# EAGLE design xen_teensy_motherboard_matrix_mki (EAGLE 9.6.0)
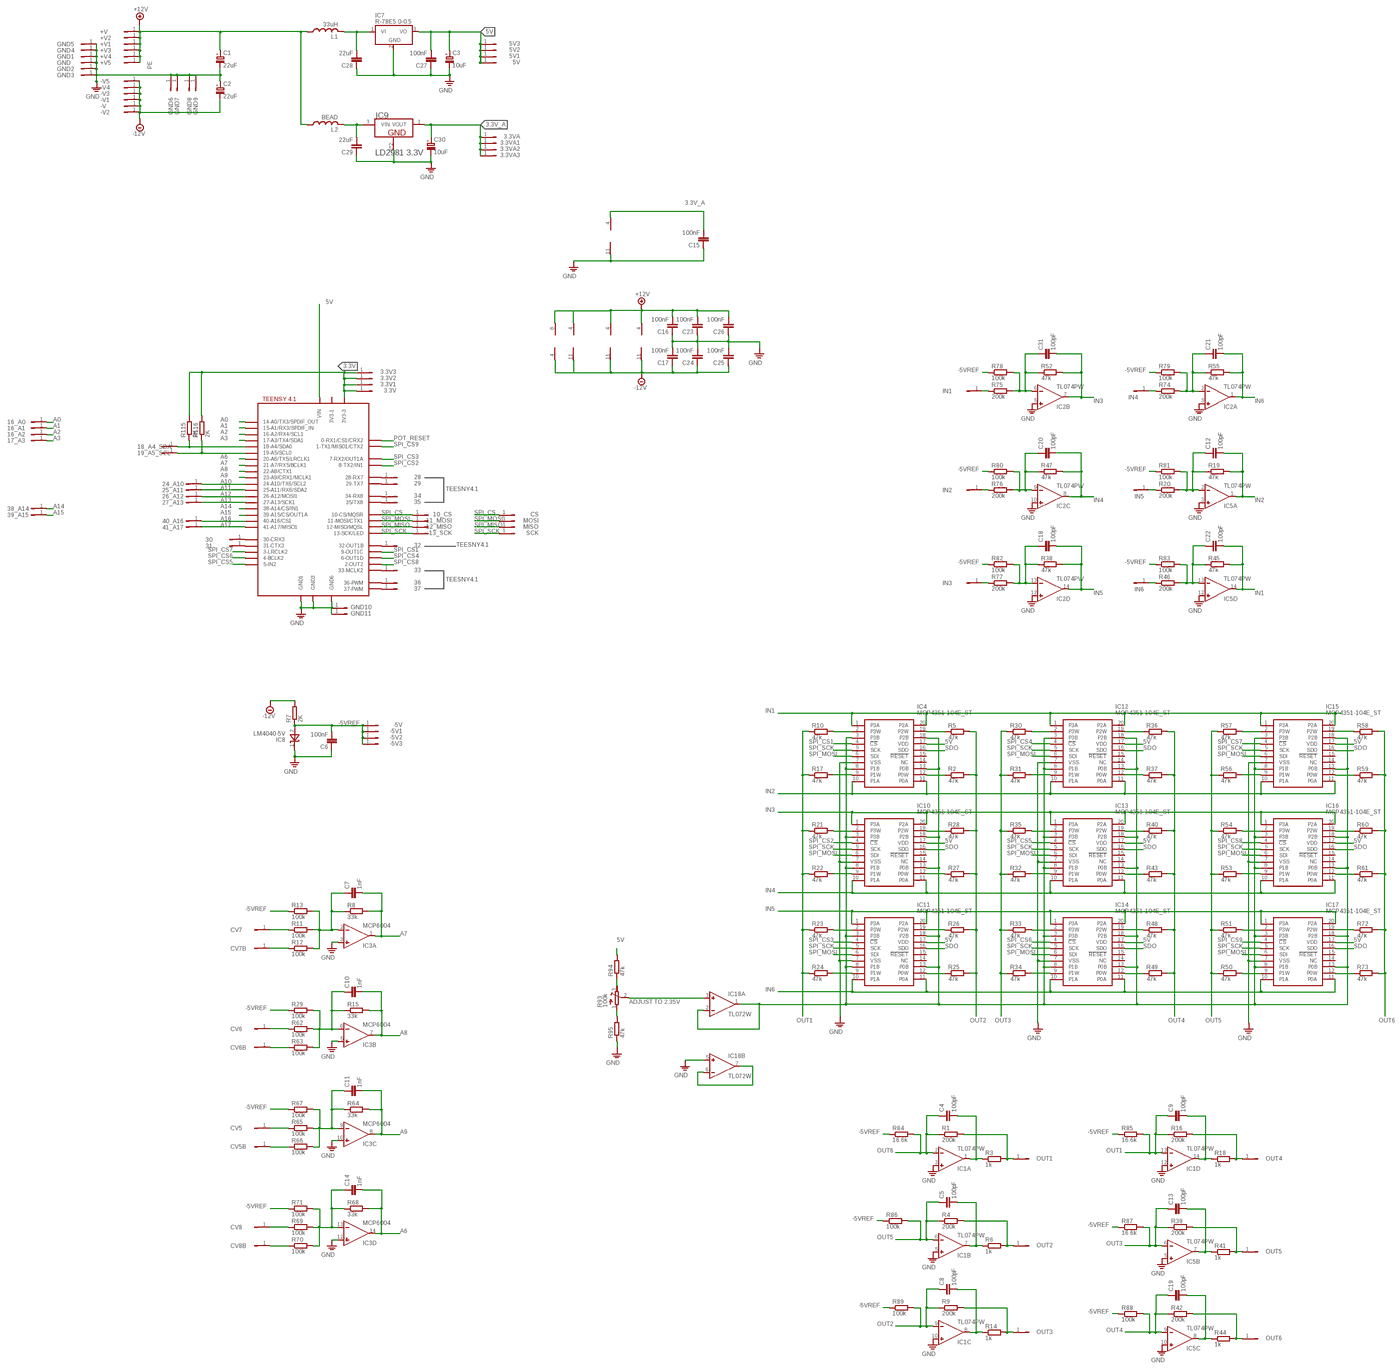
[diagram p0: schematic, sheet 1, overview]
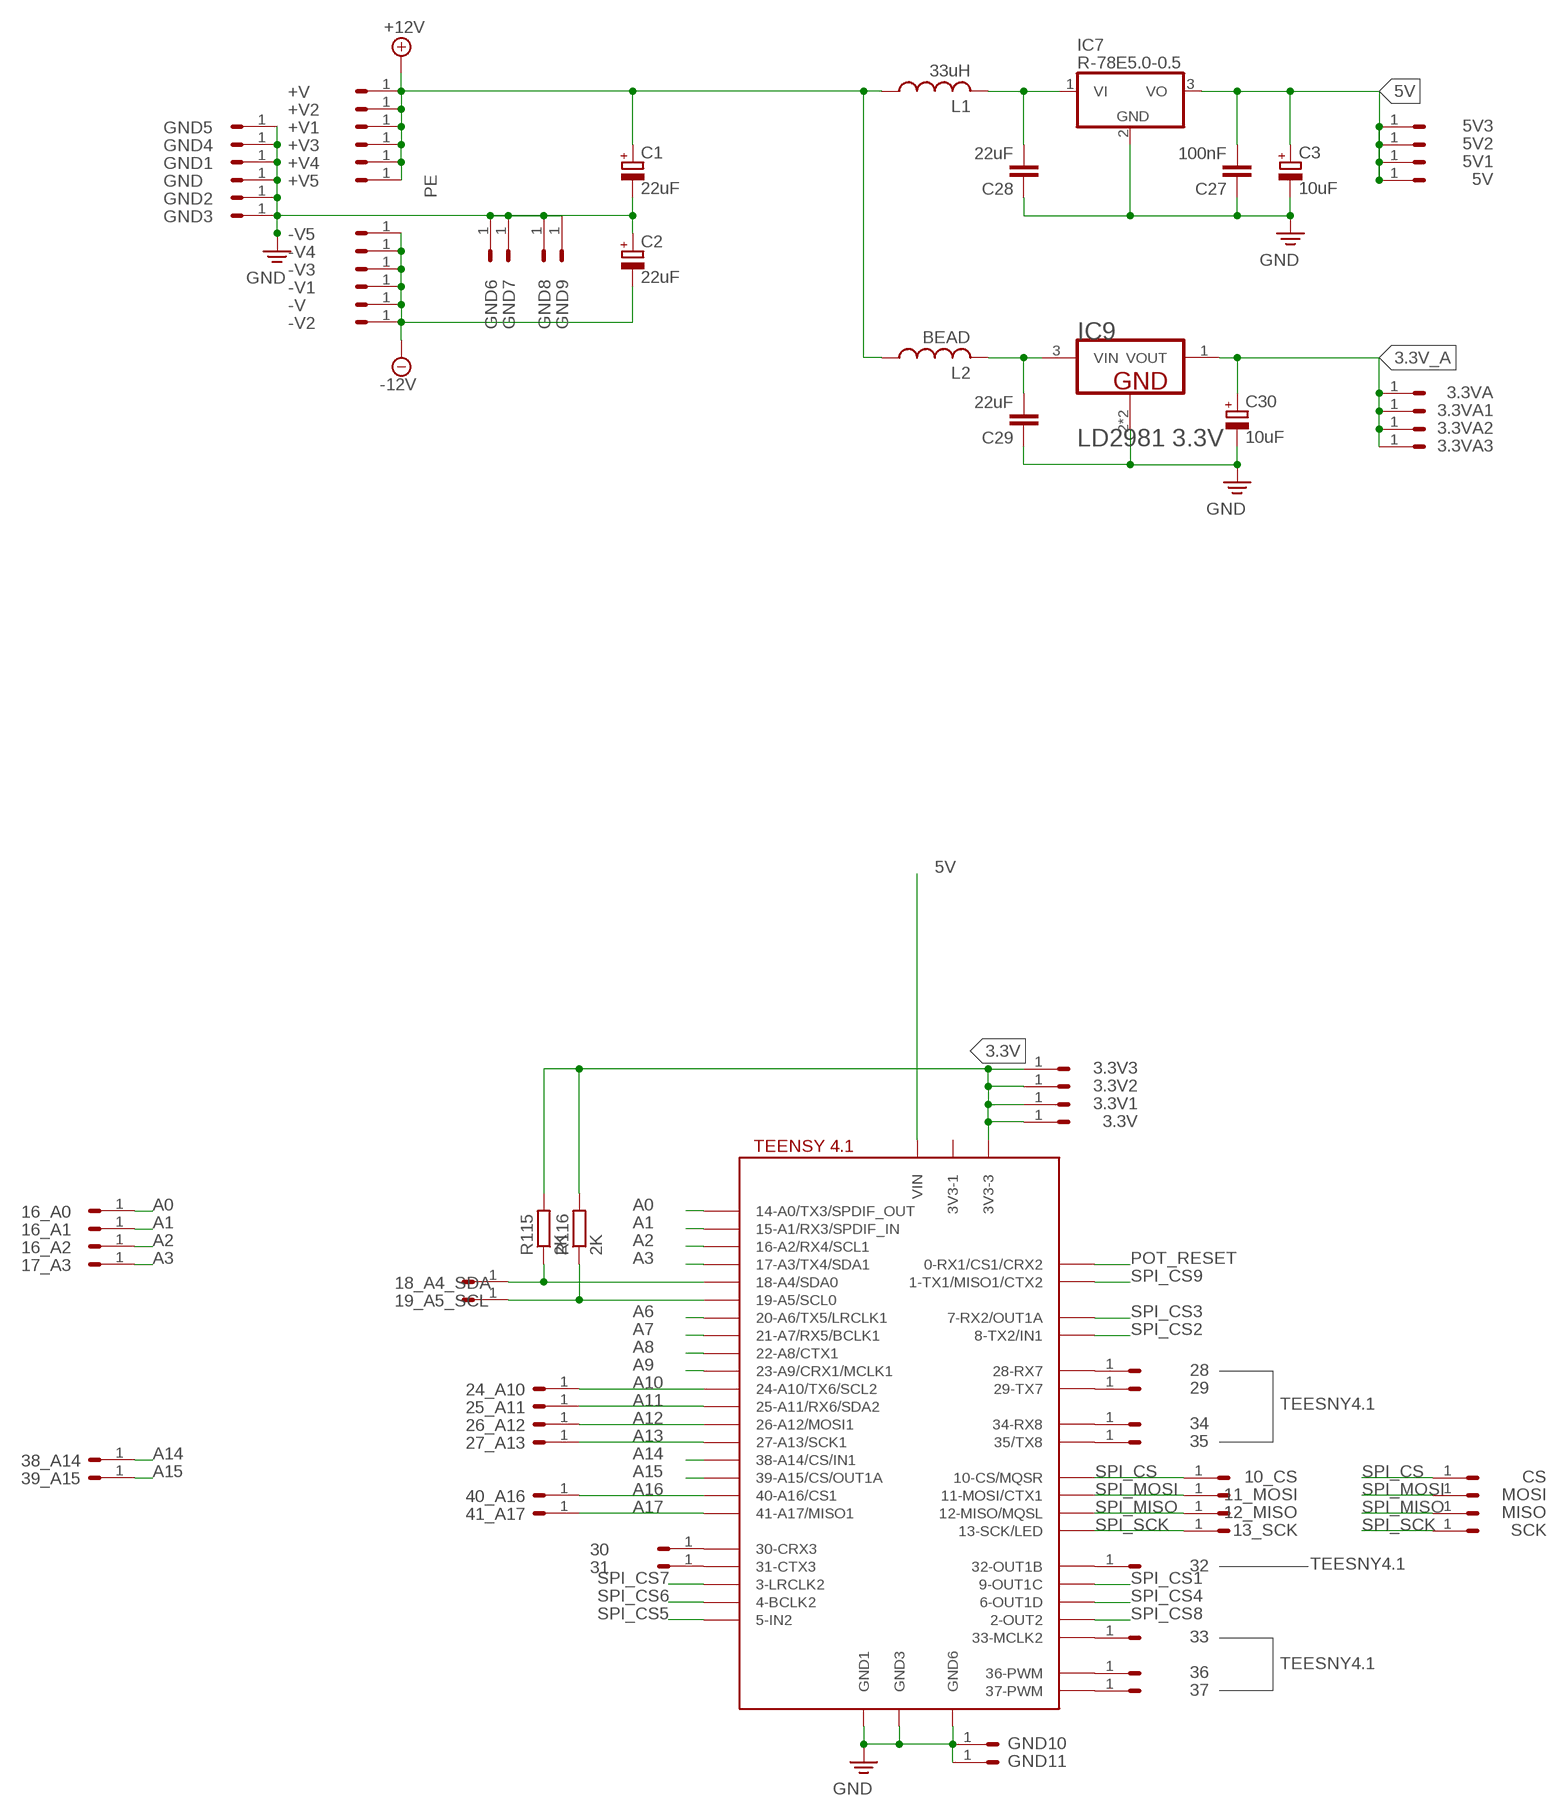
[diagram p1: schematic, sheet 1, part 1 of 4]
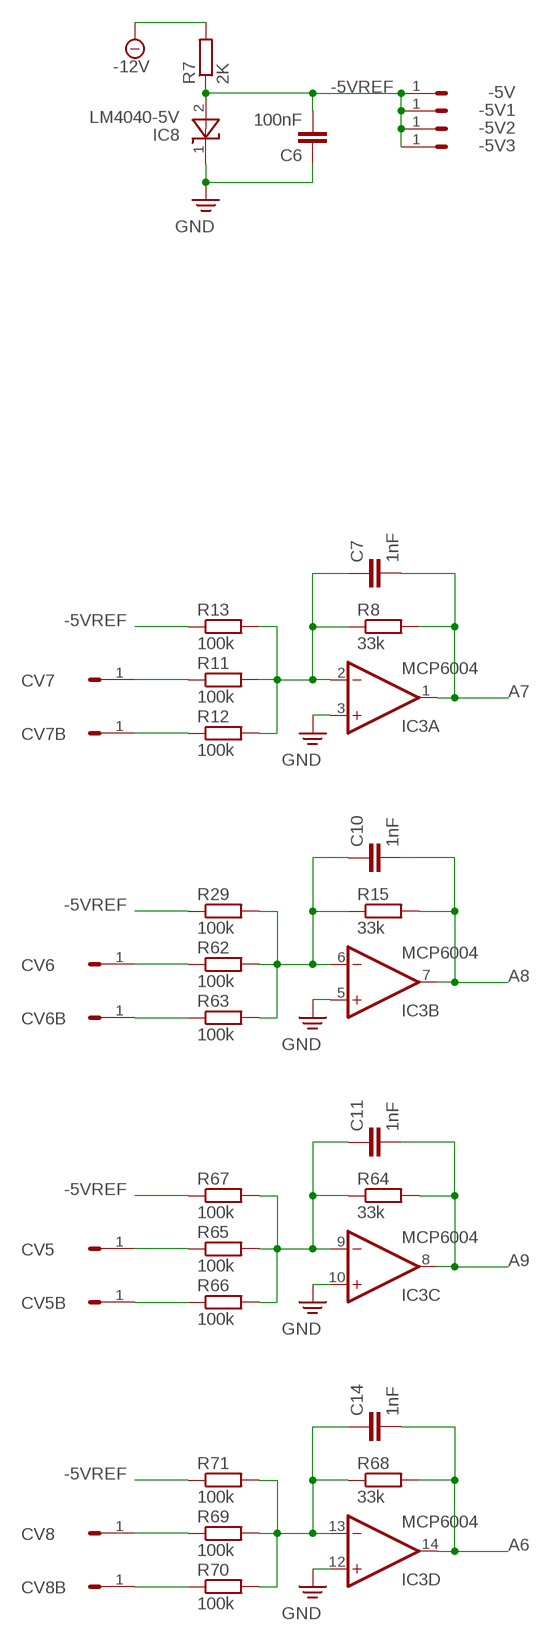
[diagram p2: schematic, sheet 1, part 2 of 4]
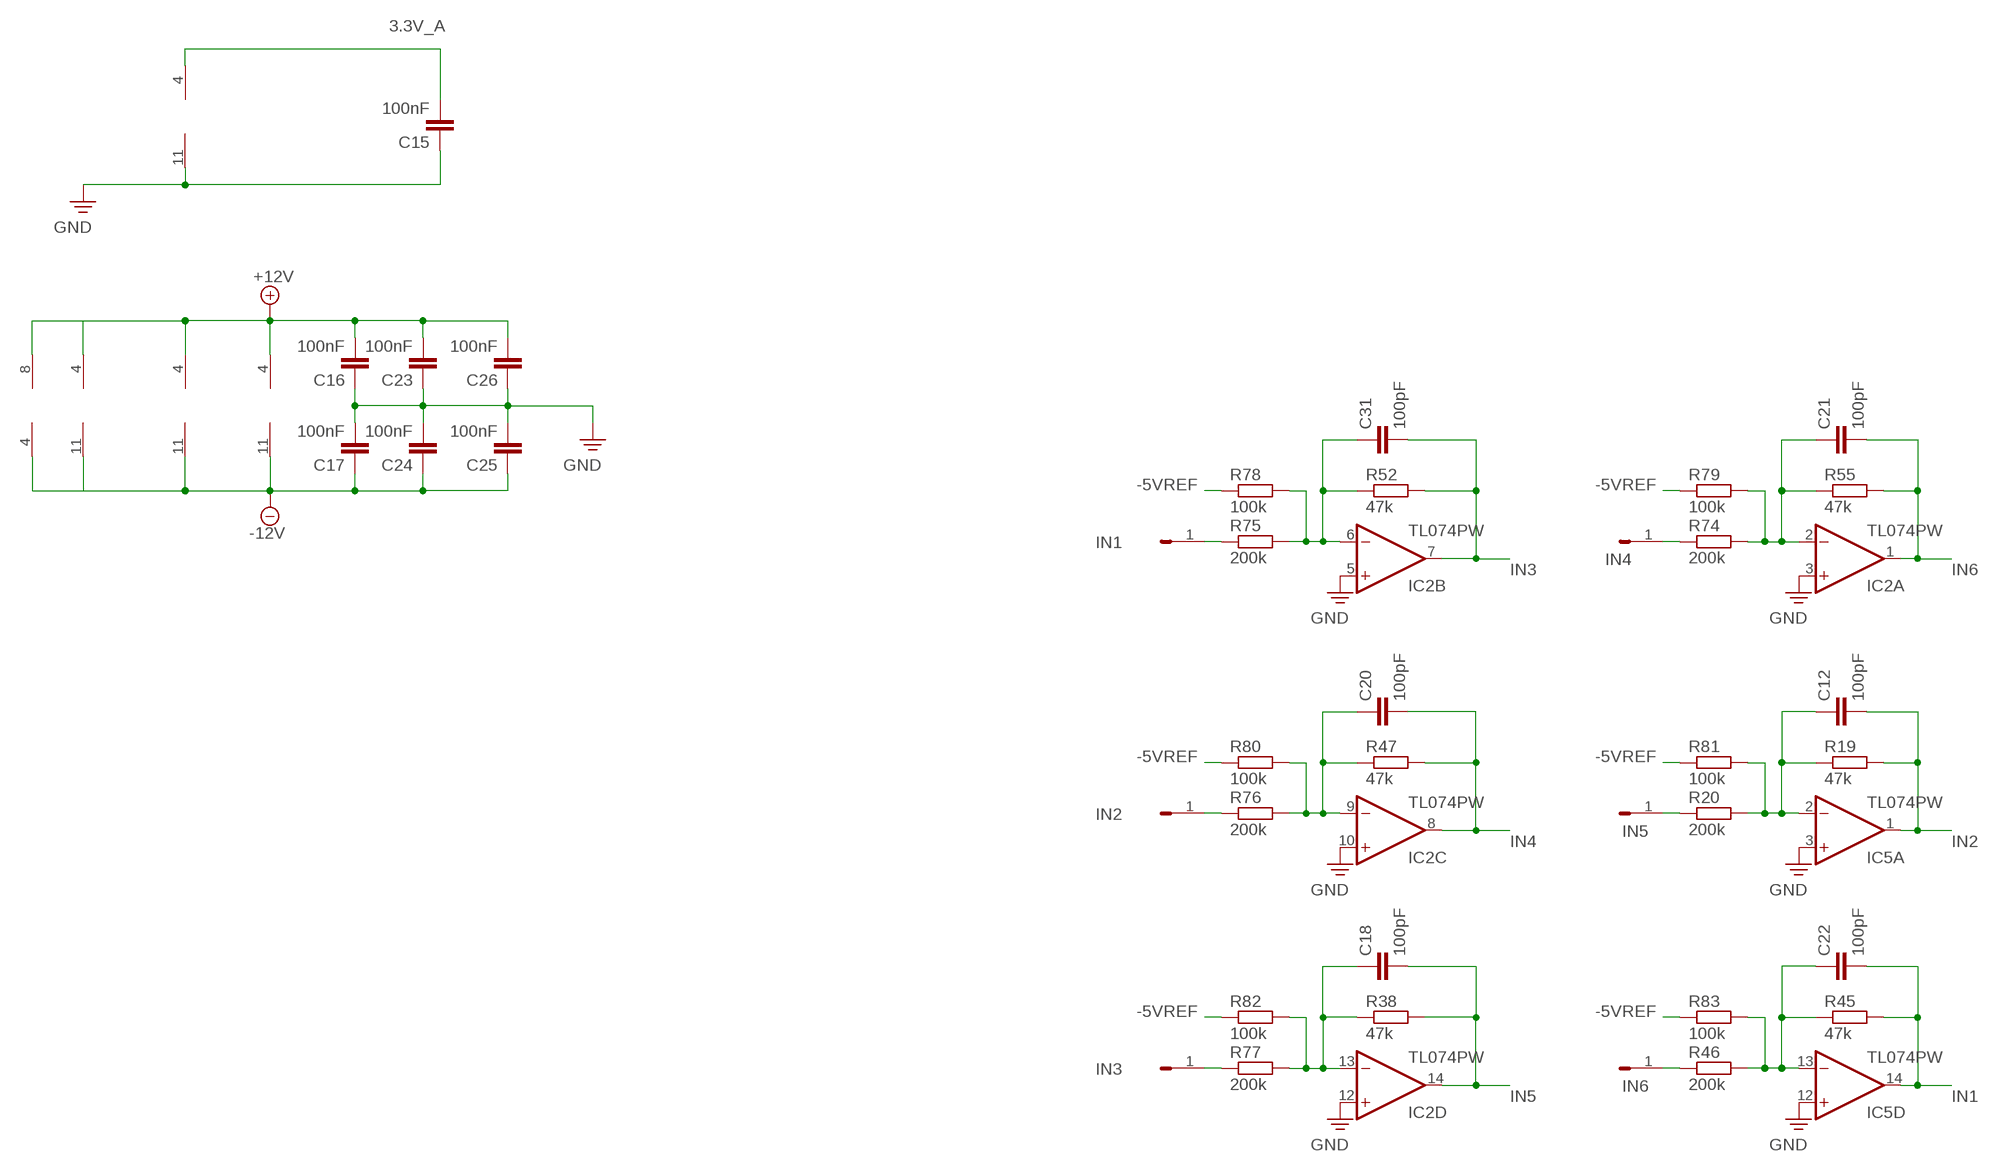
[diagram p3: schematic, sheet 1, part 3 of 4]
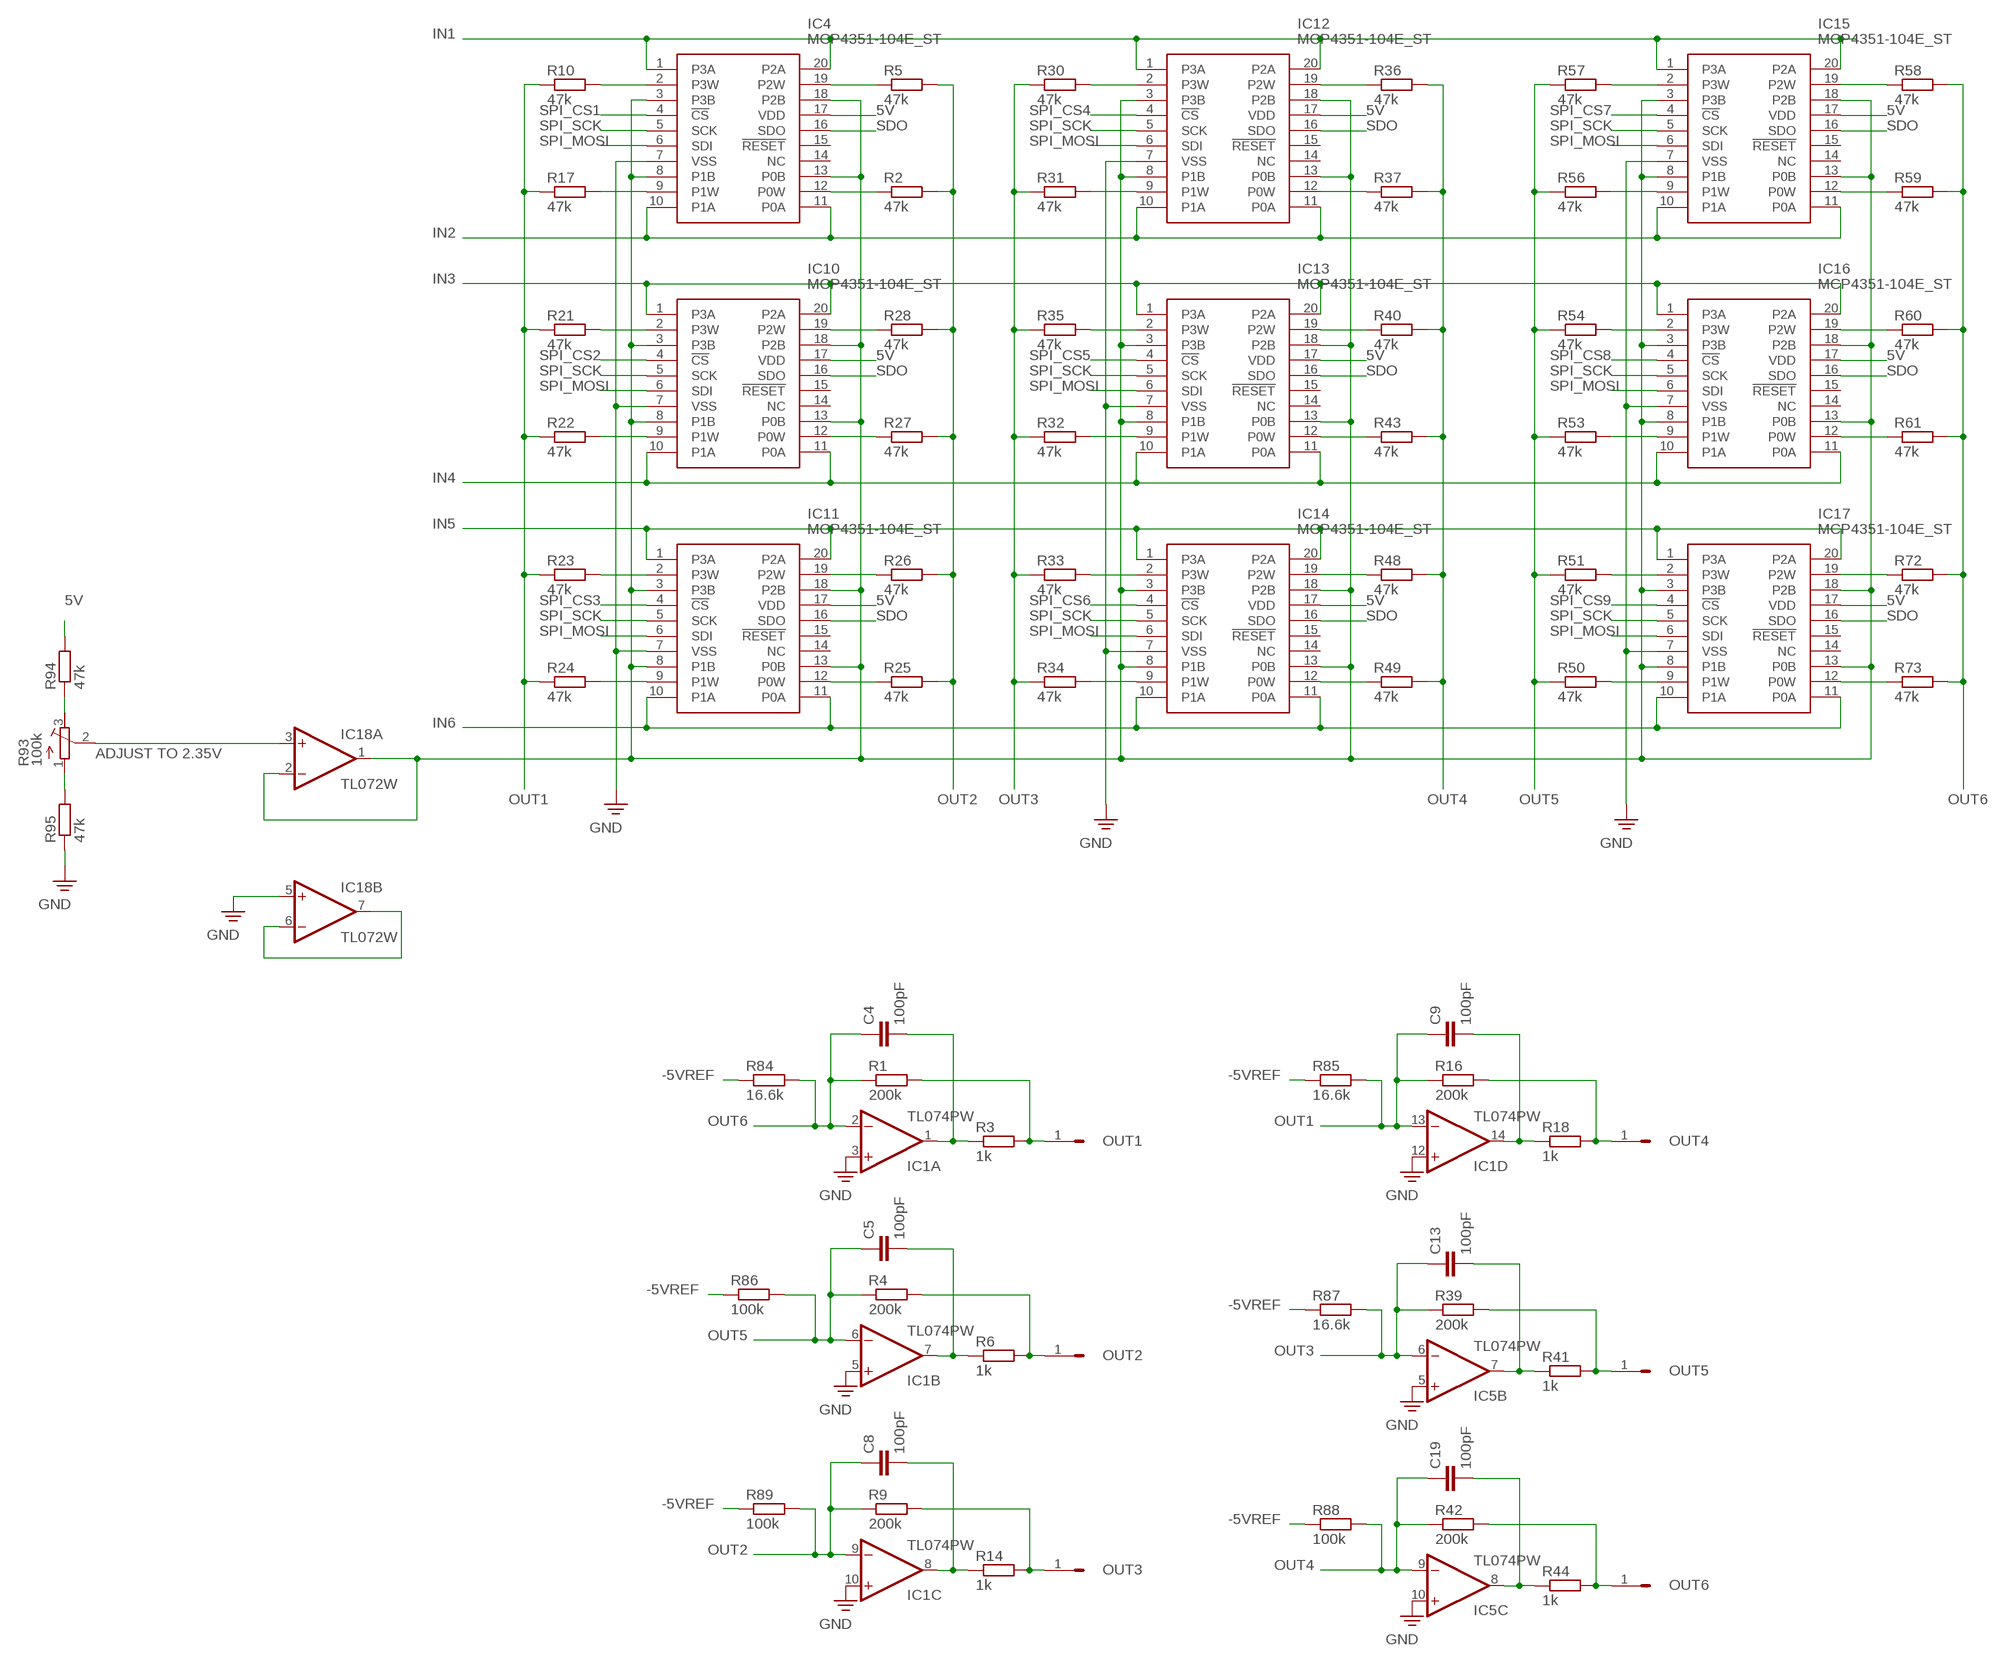
[diagram p4: schematic, sheet 1, part 4 of 4]

## Parts
3.3V  HEADER/MALE/01  [HEADER/MALE/01]
3.3V1  HEADER/MALE/01  [HEADER/MALE/01]
3.3V2  HEADER/MALE/01  [HEADER/MALE/01]
3.3V3  HEADER/MALE/01  [HEADER/MALE/01]
3.3VA  HEADER/MALE/01  [HEADER/MALE/01]
3.3VA1  HEADER/MALE/01  [HEADER/MALE/01]
3.3VA2  HEADER/MALE/01  [HEADER/MALE/01]
3.3VA3  HEADER/MALE/01  [HEADER/MALE/01]
5V  HEADER/MALE/01  [HEADER/MALE/01]
5V1  HEADER/MALE/01  [HEADER/MALE/01]
5V2  HEADER/MALE/01  [HEADER/MALE/01]
5V3  HEADER/MALE/01  [HEADER/MALE/01]
10_CS  HEADER/MALE/01  [HEADER/MALE/01]
11_MOSI  HEADER/MALE/01  [HEADER/MALE/01]
12_MISO  HEADER/MALE/01  [HEADER/MALE/01]
13_SCK  HEADER/MALE/01  [HEADER/MALE/01]
16_A0  HEADER/MALE/01  [HEADER/MALE/01]
16_A1  HEADER/MALE/01  [HEADER/MALE/01]
16_A2  HEADER/MALE/01  [HEADER/MALE/01]
17_A3  HEADER/MALE/01  [HEADER/MALE/01]
18_A4_SDA  HEADER/MALE/01  [HEADER/MALE/01]
19_A5_SCL  HEADER/MALE/01  [HEADER/MALE/01]
24_A10  HEADER/MALE/01  [HEADER/MALE/01]
25_A11  HEADER/MALE/01  [HEADER/MALE/01]
26_A12  HEADER/MALE/01  [HEADER/MALE/01]
27_A13  HEADER/MALE/01  [HEADER/MALE/01]
28  HEADER/MALE/01  [HEADER/MALE/01]
29  HEADER/MALE/01  [HEADER/MALE/01]
30  HEADER/MALE/01  [HEADER/MALE/01]
31  HEADER/MALE/01  [HEADER/MALE/01]
32  HEADER/MALE/01  [HEADER/MALE/01]
33  HEADER/MALE/01  [HEADER/MALE/01]
34  HEADER/MALE/01  [HEADER/MALE/01]
35  HEADER/MALE/01  [HEADER/MALE/01]
36  HEADER/MALE/01  [HEADER/MALE/01]
37  HEADER/MALE/01  [HEADER/MALE/01]
38_A14  HEADER/MALE/01  [HEADER/MALE/01]
39_A15  HEADER/MALE/01  [HEADER/MALE/01]
40_A16  HEADER/MALE/01  [HEADER/MALE/01]
41_A17  HEADER/MALE/01  [HEADER/MALE/01]
+V  HEADER/MALE/01  [HEADER/MALE/01]
+V1  HEADER/MALE/01  [HEADER/MALE/01]
+V2  HEADER/MALE/01  [HEADER/MALE/01]
+V3  HEADER/MALE/01  [HEADER/MALE/01]
+V4  HEADER/MALE/01  [HEADER/MALE/01]
+V5  HEADER/MALE/01  [HEADER/MALE/01]
-5V  HEADER/MALE/01  [HEADER/MALE/01]
-5V1  HEADER/MALE/01  [HEADER/MALE/01]
-5V2  HEADER/MALE/01  [HEADER/MALE/01]
-5V3  HEADER/MALE/01  [HEADER/MALE/01]
-V  HEADER/MALE/01  [HEADER/MALE/01]
-V1  HEADER/MALE/01  [HEADER/MALE/01]
-V2  HEADER/MALE/01  [HEADER/MALE/01]
-V3  HEADER/MALE/01  [HEADER/MALE/01]
-V4  HEADER/MALE/01  [HEADER/MALE/01]
-V5  HEADER/MALE/01  [HEADER/MALE/01]
C1  22uF  CAPACITOR/POLARIZEDSMDC  [SV-C]
C2  22uF  CAPACITOR/POLARIZEDSMDC  [SV-C]
C3  10uF  CAPACITOR/POLARIZEDSMDB  [SV-B]
C4  100pF  CAPACITORC0603  [C0603]
C5  100pF  CAPACITORC0603  [C0603]
C6  100nF  CAPACITORC0603  [C0603]
C7  1nF  CAPACITORC0603  [C0603]
C8  100pF  CAPACITORC0603  [C0603]
C9  100pF  CAPACITORC0603  [C0603]
C10  1nF  CAPACITORC0603  [C0603]
C11  1nF  CAPACITORC0603  [C0603]
C12  100pF  CAPACITORC0603  [C0603]
C13  100pF  CAPACITORC0603  [C0603]
C14  1nF  CAPACITORC0603  [C0603]
C15  100nF  CAPACITORC0603  [C0603]
C16  100nF  CAPACITORC0603  [C0603]
C17  100nF  CAPACITORC0603  [C0603]
C18  100pF  CAPACITORC0603  [C0603]
C19  100pF  CAPACITORC0603  [C0603]
C20  100pF  CAPACITORC0603  [C0603]
C21  100pF  CAPACITORC0603  [C0603]
C22  100pF  CAPACITORC0603  [C0603]
C23  100nF  CAPACITORC0603  [C0603]
C24  100nF  CAPACITORC0603  [C0603]
C25  100nF  CAPACITORC0603  [C0603]
C26  100nF  CAPACITORC0603  [C0603]
C27  100nF  CAPACITORC0603  [C0603]
C28  22uF  CAPACITORC0805  [C0805]
C29  22uF  CAPACITORC0805  [C0805]
C30  10uF  CAPACITOR/POLARIZEDSMDB  [SV-B]
C31  100pF  CAPACITORC0603  [C0603]
CS  HEADER/MALE/01  [HEADER/MALE/01]
CV5  HEADER/MALE/01  [HEADER/MALE/01]
CV5B  HEADER/MALE/01  [HEADER/MALE/01]
CV6  HEADER/MALE/01  [HEADER/MALE/01]
CV6B  HEADER/MALE/01  [HEADER/MALE/01]
CV7  HEADER/MALE/01  [HEADER/MALE/01]
CV7B  HEADER/MALE/01  [HEADER/MALE/01]
CV8  HEADER/MALE/01  [HEADER/MALE/01]
CV8B  HEADER/MALE/01  [HEADER/MALE/01]
GND  HEADER/MALE/01  [HEADER/MALE/01]
GND1  HEADER/MALE/01  [HEADER/MALE/01]
GND2  HEADER/MALE/01  [HEADER/MALE/01]
GND3  HEADER/MALE/01  [HEADER/MALE/01]
GND4  HEADER/MALE/01  [HEADER/MALE/01]
GND5  HEADER/MALE/01  [HEADER/MALE/01]
GND6  HEADER/MALE/01  [HEADER/MALE/01]
GND7  HEADER/MALE/01  [HEADER/MALE/01]
GND8  HEADER/MALE/01  [HEADER/MALE/01]
GND9  HEADER/MALE/01  [HEADER/MALE/01]
GND10  HEADER/MALE/01  [HEADER/MALE/01]
GND11  HEADER/MALE/01  [HEADER/MALE/01]
IC1  TL074PW  [TSSOP14]
IC2  TL074PW  [TSSOP14]
IC3  MCP6004  TL074PW  [TSSOP14]
IC4  MCP4351-104E_ST  [SOP65P640X120-20N]
IC5  TL074PW  [TSSOP14]
IC6  TEENSY41-OUTER  [TENNSY41-OUTER]
IC7  R-78E5.0-0.5  WE173950378  [WE78]
IC8  LM4040-5V  LM4040CYM3-2.5  [SOT-23]
IC9  LD2981 3.3V  LD2981LD2981-SOT89  [LD2981-SOT89]
IC10  MCP4351-104E_ST  [SOP65P640X120-20N]
IC11  MCP4351-104E_ST  [SOP65P640X120-20N]
IC12  MCP4351-104E_ST  [SOP65P640X120-20N]
IC13  MCP4351-104E_ST  [SOP65P640X120-20N]
IC14  MCP4351-104E_ST  [SOP65P640X120-20N]
IC15  MCP4351-104E_ST  [SOP65P640X120-20N]
IC16  MCP4351-104E_ST  [SOP65P640X120-20N]
IC17  MCP4351-104E_ST  [SOP65P640X120-20N]
IC18  TL072W  [TSSOP08]
IN1  HEADER/MALE/01  [HEADER/MALE/01]
IN2  HEADER/MALE/01  [HEADER/MALE/01]
IN3  HEADER/MALE/01  [HEADER/MALE/01]
IN4  HEADER/MALE/01  [HEADER/MALE/01]
IN5  HEADER/MALE/01  [HEADER/MALE/01]
IN6  HEADER/MALE/01  [HEADER/MALE/01]
L1  33uH  INDUCTORL2012C  [L2012C]
L2  BEAD  INDUCTORL0603  [R0603]
MISO  HEADER/MALE/01  [HEADER/MALE/01]
MOSI  HEADER/MALE/01  [HEADER/MALE/01]
OUT1  HEADER/MALE/01  [HEADER/MALE/01]
OUT2  HEADER/MALE/01  [HEADER/MALE/01]
OUT3  HEADER/MALE/01  [HEADER/MALE/01]
OUT4  HEADER/MALE/01  [HEADER/MALE/01]
OUT5  HEADER/MALE/01  [HEADER/MALE/01]
OUT6  HEADER/MALE/01  [HEADER/MALE/01]
R1  200k  RESISTOR  [R0603]
R2  47k  RESISTOR  [R0603]
R3  1k  RESISTOR  [R0603]
R4  200k  RESISTOR  [R0603]
R5  47k  RESISTOR  [R0603]
R6  1k  RESISTOR  [R0603]
R7  2K  RESISTOR  [R0603]
R8  33k  RESISTOR  [R0603]
R9  200k  RESISTOR  [R0603]
R10  47k  RESISTOR  [R0603]
R11  100k  RESISTOR  [R0603]
R12  100k  RESISTOR  [R0603]
R13  100k  RESISTOR  [R0603]
R14  1k  RESISTOR  [R0603]
R15  33k  RESISTOR  [R0603]
R16  200k  RESISTOR  [R0603]
R17  47k  RESISTOR  [R0603]
R18  1k  RESISTOR  [R0603]
R19  47k  RESISTOR  [R0603]
R20  200k  RESISTOR  [R0603]
R21  47k  RESISTOR  [R0603]
R22  47k  RESISTOR  [R0603]
R23  47k  RESISTOR  [R0603]
R24  47k  RESISTOR  [R0603]
R25  47k  RESISTOR  [R0603]
R26  47k  RESISTOR  [R0603]
R27  47k  RESISTOR  [R0603]
R28  47k  RESISTOR  [R0603]
R29  100k  RESISTOR  [R0603]
R30  47k  RESISTOR  [R0603]
R31  47k  RESISTOR  [R0603]
R32  47k  RESISTOR  [R0603]
R33  47k  RESISTOR  [R0603]
R34  47k  RESISTOR  [R0603]
R35  47k  RESISTOR  [R0603]
R36  47k  RESISTOR  [R0603]
R37  47k  RESISTOR  [R0603]
R38  47k  RESISTOR  [R0603]
R39  200k  RESISTOR  [R0603]
R40  47k  RESISTOR  [R0603]
R41  1k  RESISTOR  [R0603]
R42  200k  RESISTOR  [R0603]
R43  47k  RESISTOR  [R0603]
R44  1k  RESISTOR  [R0603]
R45  47k  RESISTOR  [R0603]
R46  200k  RESISTOR  [R0603]
R47  47k  RESISTOR  [R0603]
R48  47k  RESISTOR  [R0603]
R49  47k  RESISTOR  [R0603]
R50  47k  RESISTOR  [R0603]
R51  47k  RESISTOR  [R0603]
R52  47k  RESISTOR  [R0603]
R53  47k  RESISTOR  [R0603]
R54  47k  RESISTOR  [R0603]
R55  47k  RESISTOR  [R0603]
R56  47k  RESISTOR  [R0603]
R57  47k  RESISTOR  [R0603]
R58  47k  RESISTOR  [R0603]
R59  47k  RESISTOR  [R0603]
R60  47k  RESISTOR  [R0603]
R61  47k  RESISTOR  [R0603]
R62  100k  RESISTOR  [R0603]
R63  100k  RESISTOR  [R0603]
R64  33k  RESISTOR  [R0603]
R65  100k  RESISTOR  [R0603]
R66  100k  RESISTOR  [R0603]
R67  100k  RESISTOR  [R0603]
R68  33k  RESISTOR  [R0603]
R69  100k  RESISTOR  [R0603]
R70  100k  RESISTOR  [R0603]
R71  100k  RESISTOR  [R0603]
R72  47k  RESISTOR  [R0603]
R73  47k  RESISTOR  [R0603]
R74  200k  RESISTOR  [R0603]
R75  200k  RESISTOR  [R0603]
R76  200k  RESISTOR  [R0603]
R77  200k  RESISTOR  [R0603]
R78  100k  RESISTOR  [R0603]
R79  100k  RESISTOR  [R0603]
R80  100k  RESISTOR  [R0603]
R81  100k  RESISTOR  [R0603]
R82  100k  RESISTOR  [R0603]
R83  100k  RESISTOR  [R0603]
R84  16.6k  RESISTOR  [R0603]
R85  16.6k  RESISTOR  [R0603]
R86  100k  RESISTOR  [R0603]
R87  16.6k  RESISTOR  [R0603]
R88  100k  RESISTOR  [R0603]
R89  100k  RESISTOR  [R0603]
R93  100k  TRIMMER64X  [TRIMMER/64B]
R94  47k  RESISTOR  [R0603]
R95  47k  RESISTOR  [R0603]
R115  2K  RESISTOR  [R0603]
R116  2K  RESISTOR  [R0603]
SCK  HEADER/MALE/01  [HEADER/MALE/01]

## Nets
3.3V: 3.3V1.1 3.3V2.1 3.3V3.1 3.3V.1 IC6.3V3-3 R115.2 R116.2
3.3V_A: 3.3VA1.1 3.3VA2.1 3.3VA3.1 3.3VA.1 C15.2 C30.+ IC3.4(P:V+) IC9.1(VOUT)
5V: 5V1.1 5V2.1 5V3.1 5V.1 C3.+ C27.2 IC4.17(VDD) IC6.VIN IC7.3(VO) IC10.17(VDD) IC11.17(VDD) IC12.17(VDD) IC13.17(VDD) IC14.17(VDD) IC15.17(VDD) IC16.17(VDD) IC17.17(VDD) R94.2
+12V: +V1.1 +V2.1 +V3.1 +V4.1 +V5.1 +V.1 C1.+ C16.2 C23.2 C26.2 IC1.4(P:V+) IC2.4(P:V+) IC5.4(P:V+) IC18.8(P:V+) L1.1 L2.1
-5VREF: -5V1.1 -5V2.1 -5V3.1 -5V.1 C6.2 IC8.2(A) R7.1 R13.1 R29.1 R67.1 R71.1 R78.1 R79.1 R80.1 R81.1 R82.1 R83.1 R84.1 R85.1 R86.1 R87.1 R88.1 R89.1
-12V: -V1.1 -V2.1 -V3.1 -V4.1 -V5.1 -V.1 C2.- C17.1 C24.1 C25.1 IC1.11(P:V-) IC2.11(P:V-) IC5.11(P:V-) IC18.4(P:V-) R7.2
A0: 16_A0.1 IC6.14-A0/TX3/SPDIF_OUT
A1: 16_A1.1 IC6.15-A1/RX3/SPDIF_IN
A2: 16_A2.1 IC6.16-A2/RX4/SCL1
A3: 17_A3.1 IC6.17-A3/TX4/SDA1
A5: 19_A5_SCL.1 IC6.19-A5/SCL0 R116.1
A6: C14.2 IC3.14(D:OUT) IC6.20-A6/TX5/LRCLK1 R68.2
A7: C7.2 IC3.1(A:OUT) IC6.21-A7/RX5/BCLK1 R8.2
A8: C10.2 IC3.7(B:OUT) IC6.22-A8/CTX1 R15.2
A9: C11.2 IC3.8(C:OUT) IC6.23-A9/CRX1/MCLK1 R64.2
A10: 24_A10.1 IC6.24-A10/TX6/SCL2
A11: 25_A11.1 IC6.25-A11/RX6/SDA2
A12: 26_A12.1 IC6.26-A12/MOSI1
A13: 27_A13.1 IC6.27-A13/SCK1
A14: 38_A14.1 IC6.38-A14/CS/IN1
A15: 39_A15.1 IC6.39-A15/CS/OUT1A
A16: 40_A16.1 IC6.40-A16/CS1
A17: 41_A17.1 IC6.41-A17/MISO1
DAC1: IN6.1 R46.1
DAC2: IN5.1 R20.1
IN1: C22.2 IC4.1(P3A) IC4.20(P2A) IC5.14(D:OUT) IC12.1(P3A) IC12.20(P2A) IC15.1(P3A) IC15.20(P2A) R45.2
IN2: C12.2 IC4.10(P1A) IC4.11(P0A) IC5.1(A:OUT) IC12.10(P1A) IC12.11(P0A) IC15.10(P1A) IC15.11(P0A) R19.2
IN3: C31.2 IC2.7(B:OUT) IC10.1(P3A) IC10.20(P2A) IC13.1(P3A) IC13.20(P2A) IC16.1(P3A) IC16.20(P2A) R52.2
IN4: C20.2 IC2.8(C:OUT) IC10.10(P1A) IC10.11(P0A) IC13.10(P1A) IC13.11(P0A) IC16.10(P1A) IC16.11(P0A) R47.2
IN5: C18.2 IC2.14(D:OUT) IC11.1(P3A) IC11.20(P2A) IC14.1(P3A) IC14.20(P2A) IC17.1(P3A) IC17.20(P2A) R38.2
IN6: C21.2 IC2.1(A:OUT) IC11.10(P1A) IC11.11(P0A) IC14.10(P1A) IC14.11(P0A) IC17.10(P1A) IC17.11(P0A) R55.2
N$1: IC4.2(P3W) R10.2
N$2: C18.1 IC2.13(D:-IN) R38.1 R77.2 R82.2
N$3: C4.2 IC1.1(A:OUT) R3.1
N$4: OUT1.1 R1.2 R3.2
N$5: IC4.3(P3B) IC4.8(P1B) IC4.13(P0B) IC4.18(P2B) IC10.3(P3B) IC10.8(P1B) IC10.13(P0B) IC10.18(P2B) IC11.3(P3B) IC11.8(P1B) IC11.13(P0B) IC11.18(P2B) IC12.3(P3B) IC12.8(P1B) IC12.13(P0B) IC12.18(P2B) IC13.3(P3B) IC13.8(P1B) IC13.13(P0B) IC13.18(P2B) IC14.3(P3B) IC14.8(P1B) IC14.13(P0B) IC14.18(P2B) IC15.3(P3B) IC15.8(P1B) IC15.13(P0B) IC15.18(P2B) IC16.3(P3B) IC16.8(P1B) IC16.13(P0B) IC16.18(P2B) IC17.3(P3B) IC17.8(P1B) IC17.13(P0B) IC17.18(P2B) IC18.1(A:OUT) IC18.2(A:-IN)
N$6: C5.2 IC1.7(B:OUT) R6.1
N$7: OUT2.1 R4.2 R6.2
N$8: C7.1 IC3.2(A:-IN) R8.1 R11.2 R12.2 R13.2
N$9: IC18.3(A:+IN) R93.2(S)
N$10: C8.2 IC1.8(C:OUT) R14.1
N$11: OUT3.1 R9.2 R14.2
N$12: C20.1 IC2.9(C:-IN) R47.1 R76.2 R80.2
N$13: CV7B.1 R12.1
N$14: CV7.1 R11.1
N$15: C9.2 IC1.14(D:OUT) R18.1
N$16: C10.1 IC3.6(B:-IN) R15.1 R29.2 R62.2 R63.2
N$17: OUT4.1 R16.2 R18.2
N$18: CV6.1 R62.1
N$19: CV6B.1 R63.1
N$20: C12.1 IC5.2(A:-IN) R19.1 R20.2 R81.2
N$21: IC18.6(B:-IN) IC18.7(B:OUT)
N$22: IC4.9(P1W) R17.2
N$23: IC10.2(P3W) R21.2
N$24: IC10.9(P1W) R22.2
N$26: IC11.2(P3W) R23.2
N$27: IC11.9(P1W) R24.2
N$28: C31.1 IC2.6(B:-IN) R52.1 R75.2 R78.2
N$29: IC11.12(P0W) R25.1
N$30: IC11.19(P2W) R26.1
N$31: IC10.12(P0W) R27.1
N$32: IC10.19(P2W) R28.1
N$33: C13.2 IC5.7(B:OUT) R41.1
N$34: IC4.12(P0W) R2.1
N$35: IC4.19(P2W) R5.1
N$36: IC12.2(P3W) R30.2
N$37: IC12.9(P1W) R31.2
N$38: IC13.2(P3W) R35.2
N$39: IC13.9(P1W) R32.2
N$40: IC14.2(P3W) R33.2
N$41: IC14.9(P1W) R34.2
N$42: OUT5.1 R39.2 R41.2
N$43: R93.1(E) R95.2
N$44: C19.2 IC5.8(C:OUT) R44.1
N$45: 18_A4_SDA.1 IC6.18-A4/SDA0 R115.1
N$46: IC14.12(P0W) R49.1
N$47: OUT6.1 R42.2 R44.2
N$48: C22.1 IC5.13(D:-IN) R45.1 R46.2 R83.2
N$49: R93.3(A) R94.1
N$50: C21.1 IC2.2(A:-IN) R55.1 R74.2 R79.2
N$51: C28.2 IC7.1(VI) L1.2
N$52: IC14.19(P2W) R48.1
N$53: IC13.12(P0W) R43.1
N$54: IC13.19(P2W) R40.1
N$55: IC12.12(P0W) R37.1
N$56: IC12.19(P2W) R36.1
N$57: C14.1 IC3.13(D:-IN) R68.1 R69.2 R70.2 R71.2
N$58: IC15.2(P3W) R57.2
N$59: IC15.9(P1W) R56.2
N$60: CV8.1 R69.1
N$61: IC16.2(P3W) R54.2
N$62: IC16.9(P1W) R53.2
N$63: IC17.2(P3W) R51.2
N$64: IC17.9(P1W) R50.2
N$65: IC17.12(P0W) R73.1
N$66: IC17.19(P2W) R72.1
N$67: IC16.12(P0W) R61.1
N$68: CV8B.1 R70.1
N$69: CV5B.1 R66.1
N$70: CV5.1 R65.1
N$71: C11.1 IC3.9(C:-IN) R64.1 R65.2 R66.2 R67.2
N$72: C29.2 IC9.3(VIN) L2.2
N$73: IC16.19(P2W) R60.1
N$75: IC15.12(P0W) R59.1
N$76: IC15.19(P2W) R58.1
N$78: IN1.1 R75.1
N$79: IN2.1 R76.1
N$80: IN3.1 R77.1
N$81: IN4.1 R74.1
N$108: 28.1 IC6.28-RX7
N$109: 29.1 IC6.29-TX7
N$110: 30.1 IC6.30-CRX3
N$111: 31.1 IC6.31-CTX3
N$112: 32.1 IC6.32-OUT1B
N$118: 34.1 IC6.34-RX8
N$119: 35.1 IC6.35-TX8(35/TX8)
N$120: 33.1 IC6.33-MCLK2
N$121: 36.1 IC6.36-PWM
N$122: 37.1 IC6.37-PWM
OUT1: C9.1 IC1.13(D:-IN) R10.1 R16.1 R17.1 R21.1 R22.1 R23.1 R24.1 R85.2
OUT2: C8.1 IC1.9(C:-IN) R2.2 R5.2 R9.1 R25.2 R26.2 R27.2 R28.2 R89.2
OUT3: C13.1 IC5.6(B:-IN) R30.1 R31.1 R32.1 R33.1 R34.1 R35.1 R39.1 R87.2
OUT4: C19.1 IC5.9(C:-IN) R36.2 R37.2 R40.2 R42.1 R43.2 R48.2 R49.2 R88.2
OUT5: C5.1 IC1.6(B:-IN) R4.1 R50.1 R51.1 R53.1 R54.1 R56.1 R57.1 R86.2
OUT6: C4.1 IC1.2(A:-IN) R1.1 R58.2 R59.2 R60.2 R61.2 R72.2 R73.2 R84.2
PE: C1.- C2.+ C3.- C6.1 C15.1 C16.1 C17.2 C23.1 C24.2 C25.2 C26.1 C27.1 C28.1 C29.1 C30.- GND1.1 GND2.1 GND3.1 GND4.1 GND5.1 GND6.1 GND7.1 GND8.1 GND9.1 GND10.1 GND11.1 GND.1 IC1.3(A:+IN) IC1.5(B:+IN) IC1.10(C:+IN) IC1.12(D:+IN) IC2.3(A:+IN) IC2.5(B:+IN) IC2.10(C:+IN) IC2.12(D:+IN) IC3.3(A:+IN) IC3.5(B:+IN) IC3.10(C:+IN) IC3.11(P:V-) IC3.12(D:+IN) IC4.7(VSS) IC5.3(A:+IN) IC5.5(B:+IN) IC5.10(C:+IN) IC5.12(D:+IN) IC6.GND1 IC6.GND3 IC6.GND6 IC7.2(GND) IC8.1(C) IC9.2(GND) IC9.2-2(GND) IC10.7(VSS) IC11.7(VSS) IC12.7(VSS) IC13.7(VSS) IC14.7(VSS) IC15.7(VSS) IC16.7(VSS) IC17.7(VSS) IC18.5(B:+IN) R95.1 ; supply symbol labelled GND
POT_RESET: IC6.0-RX1/CS1/CRX2
SDO: IC4.16(SDO) IC10.16(SDO) IC11.16(SDO) IC12.16(SDO) IC13.16(SDO) IC14.16(SDO) IC15.16(SDO) IC16.16(SDO) IC17.16(SDO)
SPI_CS: 10_CS.1 CS.1 IC6.10-CS\MQSR(10-CS/MQSR)
SPI_CS1: IC4.4(!CS) IC6.9-OUT1C
SPI_CS2: IC6.8-TX2/IN1 IC10.4(!CS)
SPI_CS3: IC6.7-RX2/OUT1A IC11.4(!CS)
SPI_CS4: IC6.6-OUT1D IC12.4(!CS)
SPI_CS5: IC6.5-IN2 IC13.4(!CS)
SPI_CS6: IC6.4-BCLK2 IC14.4(!CS)
SPI_CS7: IC6.3-LRCLK2 IC15.4(!CS)
SPI_CS8: IC6.2-OUT2 IC16.4(!CS)
SPI_CS9: IC6.1-TX1/MISO1/CTX2 IC17.4(!CS)
SPI_MISO: 12_MISO.1 IC6.12-MISO/MQSL MISO.1
SPI_MOSI: 11_MOSI.1 IC4.6(SDI) IC6.11-MOSI/CTX1 IC10.6(SDI) IC11.6(SDI) IC12.6(SDI) IC13.6(SDI) IC14.6(SDI) IC15.6(SDI) IC16.6(SDI) IC17.6(SDI) MOSI.1
SPI_SCK: 13_SCK.1 IC4.5(SCK) IC6.13-SCK/LED IC10.5(SCK) IC11.5(SCK) IC12.5(SCK) IC13.5(SCK) IC14.5(SCK) IC15.5(SCK) IC16.5(SCK) IC17.5(SCK) SCK.1
Unconnected: IC4.14(NC) IC4.15(!RESET) IC6.3V3-1 IC10.14(NC) IC10.15(!RESET) IC11.14(NC) IC11.15(!RESET) IC12.14(NC) IC12.15(!RESET) IC13.14(NC) IC13.15(!RESET) IC14.14(NC) IC14.15(!RESET) IC15.14(NC) IC15.15(!RESET) IC16.14(NC) IC16.15(!RESET) IC17.14(NC) IC17.15(!RESET)

## Notes on the sheet
- TEESNY4.1
- TEESNY4.1
- TEESNY4.1
- ADJUST TO 2.35V

## Library data of the parts
3.3V 3.3V1-3.3V3 3.3VA 3.3VA1-3.3VA3 5V 5V1-5V3 10_CS 11_MOSI 12_MISO 13_SCK 16_A0 16_A1 16_A2 17_A3 18_A4_SDA 19_A5_SCL 24_A10 25_A11 26_A12 27_A13 28-37 38_A14 39_A15 40_A16 41_A17 +V +V1-+V5 -5V -5V1--5V3 -V -V1--V5 CS CV5 CV5B CV6 CV6B CV7 CV7B CV8 CV8B GND GND1-GND11 IN1-IN6 MISO MOSI OUT1-OUT6 SCK = connectors:HEADER/MALE/01; SPICEPREFIX: X
C1-C3 C30 = capacitors:CAPACITOR/POLARIZED: POLARIZED CAPACITOR, European symbol; SPICEPREFIX: C
C4-C29 C31 = capacitors:CAPACITOR: CAPACITOR, European symbol
IC1-IC3 IC5 = ic_analogue:TL074: OP AMP
IC4 IC10-IC17 = ic_digital:MCP4351-104E_ST: MCP4351-104E/ST, Digital Potentiometer 120k 257-Position Linear 4-channel SPI 20-Pin TSSOP Source: Datasheet <http://ww1.microchip.com/downloads/en/DeviceDoc/22242A.pdf>; ARROW_PART_NUMBER: MCP4351-104E/ST; ARROW_PRICE-STOCK: https://www.arrow.com/en/products/mcp4351-104est/microchip-technology; DESCRIPTION: MCP4351-104E/ST, Digital Potentiometer 120k 257-Position Linear 4-channel SPI 20-Pin TSSOP; HEIGHT: 1.2mm; MANUFACTURER_NAME: Microchip; MANUFACTURER_PART_NUMBER: MCP4351-104E/ST; MOUSER_PART_NUMBER: 579-MCP4351104E/ST; MOUSER_PRICE-STOCK: https://www.mouser.com/Search/Refine.aspx?Keyword=579-MCP4351104E%2FST
IC6 = microcontroller:TEENSY41-OUTER
IC7 = ic_voltage_reg:WE173950378
IC8 = ic_voltage_reg:LM4040
IC9 = ic_voltage_reg:LD2981: PM-REG-7805-SIL3; CIIVA_IDS: 1494330; COMPONENT_LINK_1_DESCRIPTION: Manufacturer URL; COMPONENT_LINK_1_URL: http://www.st.com; DATASHEET: http://www.st.com/internet/com/TECHNICAL_RESOURCES/TECHNICAL_LITERATURE/DATASHEET/CD00001635.pdf; DATASHEET_VERSION: 14/07/2008; FOOTPRINT_VARIANT_NAME_0: Level C; FOOTPRINT_VARIANT_NAME_1: Level B; FOOTPRINT_VARIANT_NAME_2: Level A; IMPORTED: yes; IMPORTED_FROM: vault; IMPORT_TS: 1521842653; MF: STMicroelectronics; MPN: LD2981CU33TR; PACKAGE: SOT-89; PACKAGE_DESCRIPTION: 3-Pin SOT-89 Package 1.5 mm Pitch, 4.1 mm Lead Span; PACKAGE_VERSION: 2011; PREFIX: U; RELEASE_DATE: 1329864115; VAULT_GUID: D31A5547-DC71-496C-B469-D3C4896B0EF1; VAULT_REVISION: 2FAEF0D7-B25B-4AA3-8C5F-6F8AF18FFD96
IC18 = ic_analogue:TL072: OP AMP
L1 L2 = resistors:INDUCTOR
R1-R89 R94 R95 R115 R116 = resistors:RESISTOR: RESISTOR, European symbol
R93 = resistors:TRIMMER: Trimm resistor

## Board
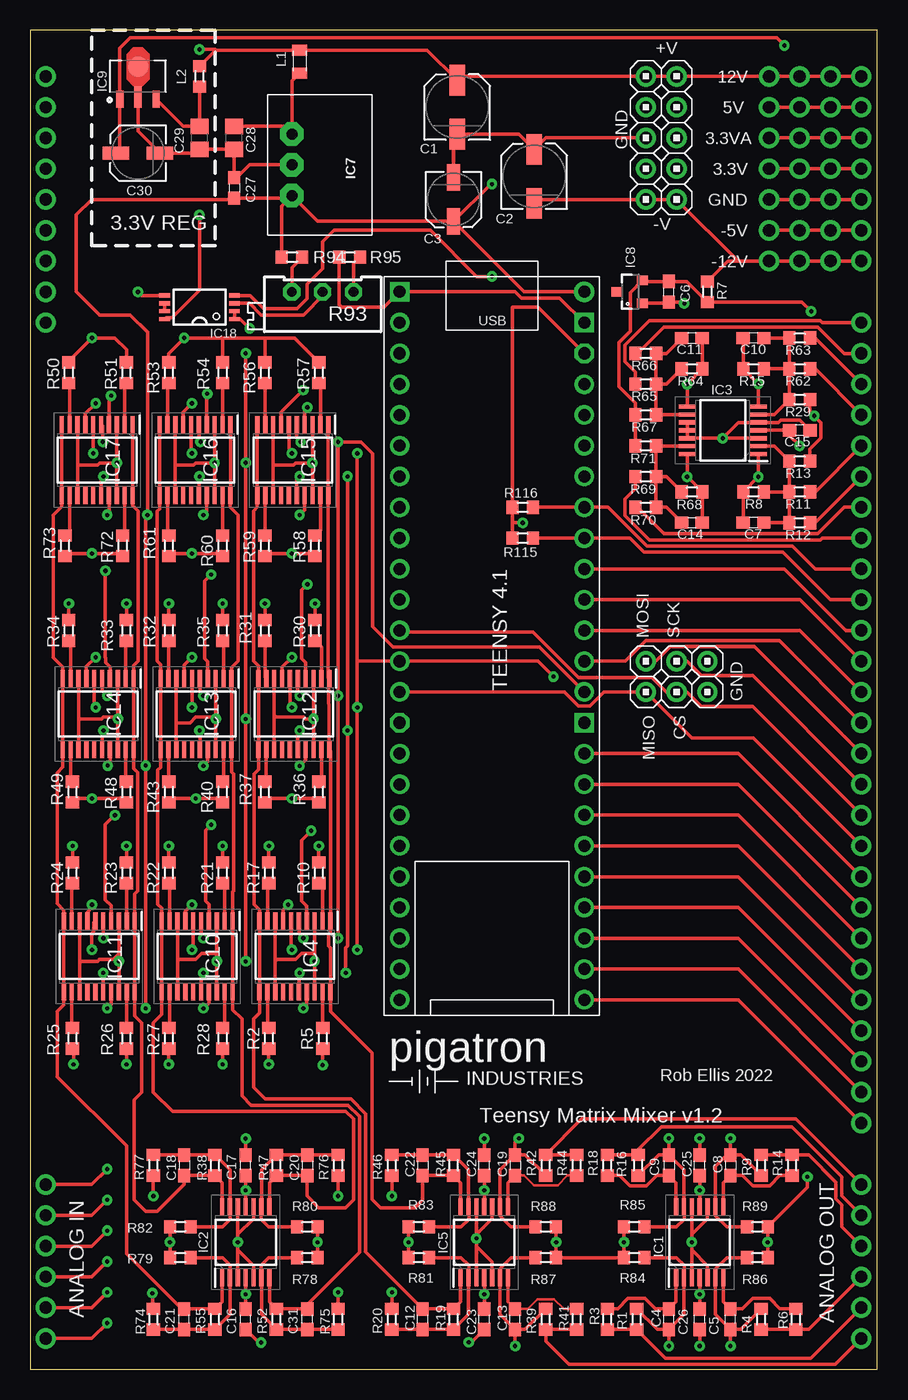
[diagram p5: board, top side]
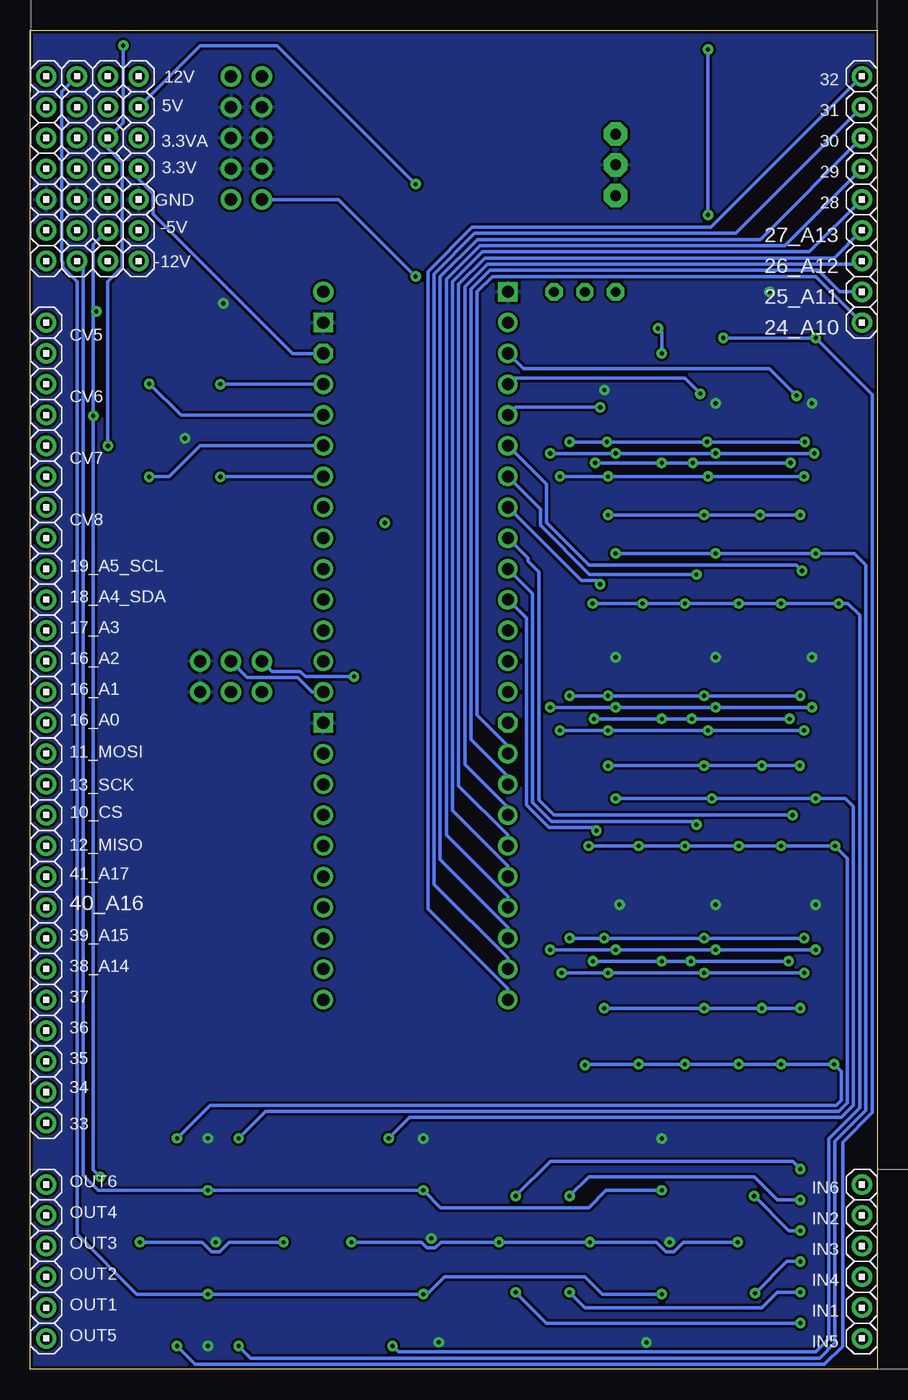
[diagram p6: board, bottom side, seen from below]

Size 69.9 x 110.48 mm. Coordinates in mm from the lower left corner, seen from the top.
Outline: 0,0 69.9,0 69.9,110.48 0,110.48 0,0
Copper layers (1*16): Top 0.0356mm / dielectric 1.5011mm / Bottom 0.0356mm
Design rules "pigatron *": minimum track width 8mil, minimum drill 13mil, track to track 8mil, track to pad 8mil, pad to pad 8mil, via to via 8mil, smd to smd 6mil, copper to edge 10mil, drill to drill 10mil, minimum pad ring 12mil, minimum via ring 10mil, stop-mask expansion 4mil, vias tented up to drill 15mil, thermal gap 10mil

### Footprints (pad centres in the part's own frame; a part is rotated, then mirrored left to right if it is on the bottom)
HEADER/MALE/01 = drill 1.016 pad 1.676: 1 0,0
SV-C = smd 2.54 x 1.27: + -2.223,0; - 2.223,0
SV-B = smd 2.184 x 1.067: + -1.81,0; - 1.81,0
C0603 = smd 1.1 x 1: 1 -0.85,0; 2 0.85,0
C0805 = smd 1.3 x 1.5: 1 -0.95,0; 2 0.95,0
TSSOP14 = smd 0.35 x 1.4: 1 -1.95,-2.938; 2 -1.3,-2.938; 3 -0.65,-2.938; 4 0,-2.938; 5 0.65,-2.938; 6 1.3,-2.938; 7 1.95,-2.938; 8 1.95,2.938; 9 1.3,2.938; 10 0.65,2.938; 11 0,2.938; 12 -0.65,2.938; 13 -1.3,2.938; 14 -1.95,2.938
SOP65P640X120-20N = smd 1.4 x 0.35: 1 -2.938,2.925; 2 -2.938,2.275; 3 -2.938,1.625; 4 -2.938,0.975; 5 -2.938,0.325; 6 -2.938,-0.325; 7 -2.938,-0.975; 8 -2.938,-1.625; 9 -2.938,-2.275; 10 -2.938,-2.925; 11 2.938,-2.925; 12 2.938,-2.275; 13 2.938,-1.625; 14 2.938,-0.975; 15 2.938,-0.325; 16 2.938,0.325; 17 2.938,0.975; 18 2.938,1.625; 19 2.938,2.275; 20 2.938,2.925
TENNSY41-OUTER = drill 1: 0-RX1/CS1/CRX2 -27.94,-7.62; 1-TX1/MISO1/CTX2 -25.4,-7.62; 2-OUT2 -22.86,-7.62; 3-LRCLK2 -20.32,-7.62; 4-BCLK2 -17.78,-7.62; 5-IN2 -15.24,-7.62; 6-OUT1D -12.7,-7.62; 7-RX2/OUT1A -10.16,-7.62; 8-TX2/IN1 -7.62,-7.62; 9-OUT1C -5.08,-7.62; 10-CS\MQSR -2.54,-7.62; 11-MOSI/CTX1 0,-7.62; 12-MISO/MQSL 2.54,-7.62; 13-SCK/LED 2.54,7.62; 14-A0/TX3/SPDIF_OUT 0,7.62; 15-A1/RX3/SPDIF_IN -2.54,7.62; 16-A2/RX4/SCL1 -5.08,7.62; 17-A3/TX4/SDA1 -7.62,7.62; 18-A4/SDA0 -10.16,7.62; 19-A5/SCL0 -12.7,7.62; 20-A6/TX5/LRCLK1 -15.24,7.62; 21-A7/RX5/BCLK1 -17.78,7.62; 22-A8/CTX1 -20.32,7.62; 23-A9/CRX1/MCLK1 -22.86,7.62; 24-A10/TX6/SCL2 7.62,-7.62; 25-A11/RX6/SDA2 10.16,-7.62; 26-A12/MOSI1 12.7,-7.62; 27-A13/SCK1 15.24,-7.62; 28-RX7 17.78,-7.62; 29-TX7 20.32,-7.62; 30-CRX3 22.86,-7.62; 31-CTX3 25.4,-7.62; 32-OUT1B 27.94,-7.62; 33-MCLK2 27.94,7.62; 34-RX8 25.4,7.62; 35-TX8 22.86,7.62; 36-PWM 20.32,7.62; 37-PWM 17.78,7.62; 38-A14/CS/IN1 15.24,7.62; 39-A15/CS/OUT1A 12.7,7.62; 40-A16/CS1 10.16,7.62; 41-A17/MISO1 7.62,7.62 | drill 1 octagon: 3V3-1 5.08,-7.62; 3V3-3 -25.4,7.62 | drill 1 square: GND1 -30.48,-7.62; GND3 5.08,7.62; GND6 -27.94,7.62 | drill 1 pad 1.676: VIN -30.48,7.62
WE78 = drill 0.9 pad 1.93 octagon: 1 -2.54,0; 2 0,0; 3 2.54,0
SOT-23 = smd 0.8 x 0.9: 1 -0.95,-1; 2 0.95,-1; 3 0,1.1
LD2981-SOT89 = smd 1.4 x 0.6: 1 -1.9,1.5; 3 -1.9,-1.5 | smd 1.8 x 0.6: 2 -1.7,0 | smd 1.71 x 1.71: 2-2 0.8,0
TSSOP08 = smd 0.9 x 0.35: 1 -2.875,0.975; 2 -2.875,0.325; 3 -2.875,-0.325; 4 -2.875,-0.975; 5 2.875,-0.975; 6 2.875,-0.325; 7 2.875,0.325; 8 2.875,0.975
L2012C = smd 0.9 x 1.25: 1 -0.9,0; 2 1,0
R0603 = smd 1 x 1.1: 1 -0.85,0; 2 0.85,0
TRIMMER/64B = drill 0.813 octagon: 1 1.27,-2.54; 2 1.27,0; 3 1.27,2.54

### Placement (x,y rotation side)
3.3V  60.96,99.06 90 bottom
3.3V1  63.5,99.06 180 bottom
3.3V2  66.04,99.06 0 bottom
3.3V3  68.58,99.06 0 bottom
3.3VA  60.96,101.6 180 bottom
3.3VA1  63.5,101.6 0 bottom
3.3VA2  66.04,101.6 0 bottom
3.3VA3  68.58,101.6 0 bottom
5V  60.96,104.14 180 bottom
5V1  63.5,104.14 180 bottom
5V2  66.04,104.14 0 bottom
5V3  68.58,104.14 0 bottom
10_CS  68.58,45.72 0 bottom
11_MOSI  68.58,50.8 0 bottom
12_MISO  68.58,43.18 0 bottom
13_SCK  68.58,48.26 0 bottom
16_A0  68.58,53.34 0 bottom
16_A1  68.58,55.88 0 bottom
16_A2  68.58,58.42 0 bottom
17_A3  68.58,60.96 0 bottom
18_A4_SDA  68.58,63.5 0 bottom
19_A5_SCL  68.58,66.04 0 bottom
24_A10  1.27,86.36 180 bottom
25_A11  1.27,88.9 180 bottom
26_A12  1.27,91.44 180 bottom
27_A13  1.27,93.98 180 bottom
28  1.27,96.52 180 bottom
29  1.27,99.06 180 bottom
30  1.27,101.6 180 bottom
31  1.27,104.14 180 bottom
32  1.27,106.68 180 bottom
33  68.58,20.32 0 bottom
34  68.58,22.86 0 bottom
35  68.58,25.4 0 bottom
36  68.58,27.94 0 bottom
37  68.58,30.48 0 bottom
38_A14  68.58,33.02 0 bottom
39_A15  68.58,35.56 0 bottom
40_A16  68.58,38.1 0 bottom
41_A17  68.58,40.64 0 bottom
+V  53.34,106.68 0 top
+V1  63.5,106.68 0 bottom
+V2  50.8,106.68 180 top
+V3  60.96,106.68 0 bottom
+V4  66.04,106.68 0 bottom
+V5  68.58,106.68 0 bottom
-5V  63.5,93.98 180 bottom
-5V1  60.96,93.98 180 bottom
-5V2  66.04,93.98 0 bottom
-5V3  68.58,93.98 0 bottom
-V  53.34,96.52 0 top
-V1  60.96,91.44 0 bottom
-V2  50.8,96.52 180 top
-V3  63.5,91.44 0 bottom
-V4  66.04,91.44 0 bottom
-V5  68.58,91.44 0 bottom
C1  35.24,104.14 270 top
C2  41.59,98.42 270 top
C3  34.92,96.52 90 top
C4  52.7,4.13 90 top
C5  57.78,4.13 90 top
C6  52.7,88.9 90 top
C7  59.69,69.85 180 top
C8  57.78,16.83 270 top
C9  52.7,16.83 270 top
C10  59.69,85.09 180 top
C11  54.61,85.09 0 top
C12  32.38,4.13 90 top
C13  40.01,4.13 90 top
C14  54.61,69.85 0 top
C15  63.5,77.47 180 top
C16  17.78,4.13 90 top
C17  17.78,16.83 90 top
C18  12.7,16.83 270 top
C19  40.01,16.83 270 top
C20  22.86,16.83 270 top
C21  12.7,4.13 90 top
C22  32.38,16.83 270 top
C23  37.47,4.13 90 top
C24  37.47,16.83 90 top
C25  55.24,16.83 90 top
C26  55.24,4.13 90 top
C27  16.83,97.47 270 top
C28  16.83,101.6 90 top
C29  13.97,101.6 90 top
C30  8.89,100.33 0 top
C31  22.86,4.13 90 top
CS  53.34,55.88 270 top
CV5  68.58,86.36 0 bottom
CV5B  68.58,83.82 0 bottom
CV6  68.58,78.74 0 bottom
CV6B  68.58,81.28 0 bottom
CV7  68.58,76.2 0 bottom
CV7B  68.58,73.66 0 bottom
CV8  68.58,68.58 0 bottom
CV8B  68.58,71.12 0 bottom
GND  53.34,101.6 0 top
GND1  53.34,104.14 0 top
GND2  50.8,99.06 180 top
GND3  53.34,99.06 180 top
GND4  50.8,101.6 0 top
GND5  50.8,104.14 0 top
GND6  63.5,96.52 0 bottom
GND7  60.96,96.52 0 bottom
GND8  66.04,96.52 0 bottom
GND9  68.58,96.52 0 bottom
GND10  55.88,58.42 90 top
GND11  55.88,55.88 270 top
IC1  55.24,10.48 0 top
IC2  17.78,10.48 0 top
IC3  57.15,77.47 90 top
IC4  21.84,34.05 270 top
IC5  37.47,10.48 0 top
IC6  38.1,58.42 270 top
IC7  21.59,99.38 270 top
IC8  49.53,88.9 90 top
IC9  8.89,106.68 90 top
IC10  13.77,34.05 270 top
IC11  5.7,34.05 270 top
IC12  21.75,54.06 270 top
IC13  13.68,54.06 270 top
IC14  5.61,54.06 270 top
IC15  21.66,75.01 270 top
IC16  13.59,75.01 270 top
IC17  5.52,75.01 270 top
IC18  13.97,87.63 180 top
IN1  1.27,5.08 180 bottom
IN2  1.27,12.7 180 bottom
IN3  1.27,10.16 180 bottom
IN4  1.27,7.62 180 bottom
IN5  1.27,2.54 180 bottom
IN6  1.27,15.24 180 bottom
L1  22.23,107.95 270 top
L2  13.97,106.68 270 top
MISO  50.8,55.88 270 top
MOSI  50.8,58.42 90 top
OUT1  68.58,5.08 0 bottom
OUT2  68.58,7.62 0 bottom
OUT3  68.58,10.16 0 bottom
OUT4  68.58,12.7 0 bottom
OUT5  68.58,2.54 0 bottom
OUT6  68.58,15.24 0 bottom
R1  50.04,4.13 270 top
R2  19.68,27.3 270 top
R3  47.62,4.13 270 top
R4  60.33,4.13 270 top
R5  24.13,27.3 270 top
R6  63.18,4.13 270 top
R7  55.88,88.9 90 top
R8  59.69,72.39 180 top
R9  60.33,16.83 90 top
R10  23.81,40.96 270 top
R11  63.5,72.39 180 top
R12  63.5,69.85 180 top
R13  63.5,74.93 180 top
R14  62.87,16.83 90 top
R15  59.69,82.55 180 top
R16  50.16,16.83 90 top
R17  19.68,40.96 270 top
R18  47.62,16.83 90 top
R19  34.92,4.13 90 top
R20  29.84,4.13 270 top
R21  15.88,40.96 270 top
R22  11.43,40.96 270 top
R23  7.94,40.96 270 top
R24  3.49,40.96 270 top
R25  3.49,27.3 270 top
R26  7.94,27.3 270 top
R27  11.43,27.3 270 top
R28  15.88,27.3 270 top
R29  63.5,80.01 180 top
R30  23.5,60.96 270 top
R31  19.37,60.96 270 top
R32  11.43,60.96 270 top
R33  7.94,60.96 270 top
R34  3.17,60.96 270 top
R35  15.88,60.96 270 top
R36  23.81,47.62 270 top
R37  19.37,47.62 270 top
R38  15.24,16.83 270 top
R39  42.55,4.13 270 top
R40  15.88,47.62 270 top
R41  45.09,4.13 270 top
R42  42.55,16.83 90 top
R43  11.43,47.62 270 top
R44  45.09,16.83 90 top
R45  34.92,16.83 270 top
R46  29.84,16.83 90 top
R47  20.32,16.83 270 top
R48  7.94,47.62 270 top
R49  3.49,47.62 270 top
R50  3.17,82.23 270 top
R51  7.94,82.23 270 top
R52  20.32,4.13 90 top
R53  11.43,82.23 270 top
R54  15.88,82.23 270 top
R55  15.24,4.13 90 top
R56  19.37,82.23 270 top
R57  23.81,82.23 270 top
R58  23.5,67.94 270 top
R59  19.37,67.94 270 top
R60  15.88,67.94 270 top
R61  11.43,67.94 270 top
R62  63.5,82.55 180 top
R63  63.5,85.09 180 top
R64  54.61,82.55 0 top
R65  50.8,81.28 0 top
R66  50.8,83.82 0 top
R67  50.8,78.74 0 top
R68  54.61,72.39 0 top
R69  50.8,73.66 0 top
R70  50.8,71.12 0 top
R71  50.8,76.2 0 top
R72  7.62,67.94 270 top
R73  2.86,67.94 270 top
R74  10.16,4.13 270 top
R75  25.4,4.13 270 top
R76  25.4,16.83 90 top
R77  10.16,16.83 90 top
R78  22.86,9.21 180 top
R79  12.38,9.21 0 top
R80  22.86,11.75 180 top
R81  32.07,9.21 0 top
R82  12.38,11.75 0 top
R83  32.07,11.75 0 top
R84  49.85,9.21 0 top
R85  49.85,11.75 0 top
R86  60.01,9.21 180 top
R87  42.55,9.21 180 top
R88  42.55,11.75 180 top
R89  60.01,11.75 180 top
R93  24.13,87.63 90 top
R94  21.59,91.76 180 top
R95  26.35,91.76 0 top
R115  40.64,68.58 180 top
R116  40.64,71.12 180 top
SCK  53.34,58.42 90 top
U$1  [PIGATRON-LOGO]  38.48,25.34 0 top

### Tracks (layer width: path | path; a pad name or v marks a point on that pad's centre or on a via)
3.3V  (via drill 0.35)
  Top 0.305: 39.79,69.85 R116.2 39.79,87.63 41.91,87.63 IC6.3V3-3 | 39.79,69.85 R115.2 | 3.3V.1 3.3V1.1 3.3V2.1 3.3V3.1 | 39.79,69.85 v40.64,69.85
  Bottom 0.305: IC6.3V3-3 48.26,83.82 59.77,95.33 59.77,97.01 60.96,98.21 3.3V.1
3.3V_A  (via drill 0.35)
  Top 0.305: C30.+ 7.39,100.64 IC9.1 7.39,108.99 8.26,109.86 61.59,109.86 v62.23,109.22 | IC3.4 C15.2 62.65,77.05 v63.5,76.2 | 3.3VA.1 3.3VA1.1 3.3VA2.1 3.3VA3.1
  Bottom 0.305: v62.23,109.22 62.23,102.87 3.3VA1.1 63.5,100.75 62.31,99.55 62.31,90.95 63.5,89.75 v63.5,76.2
5V  (via drill 0.35)
  Top 0.305: IC7.3 21.38,96.62 C27.2 16.73,96.52 5.08,96.52 3.81,95.25 3.81,88.9 5.71,87 8.26,87 9.68,85.58 v9.68,70.48 9.53,70.33 v9.53,49.81 v9.53,29.78 | IC7.3 23.72,94.71 C3.+ | C3.+ 40.73,88.9 IC6.VIN | 5V3.1 5V2.1 5V1.1 5V.1 | C3.+ 38.01,97.79 v38.1,97.79 | IC17.17 6.5,70.63 v6.35,70.48 | v22.23,70.48 22.64,70.9 IC15.17 | v14.29,70.48 14.57,70.77 IC16.17 | v6.39,49.81 6.58,50 IC14.17 | v22.23,49.78 22.73,50.29 IC12.17 | v14.29,49.78 14.65,50.15 IC13.17 | v6.35,29.78 6.67,30.1 IC11.17 | v22.54,29.78 22.82,30.05 IC4.17 | v14.29,29.78 14.74,30.24 IC10.17 | R94.2 20.74,95.99 IC7.3
  Bottom 0.305: v38.1,97.79 49.53,109.22 55.88,109.22 5V.1 | v22.23,70.48 v14.29,70.48 v9.68,70.48 v6.35,70.48 | v6.39,49.81 v9.53,49.81 14.27,49.81 | 14.27,49.81 22.2,49.81 v22.23,49.78 | v14.29,49.78 14.27,49.81 | v22.54,29.78 v14.29,29.78 v9.53,29.78 v6.35,29.78
+12V  (via drill 0.35)
  Top 0.305: 15.29,108.85 L1.1 32.76,108.85 C1.+ 35.56,106.68 +V2.1 +V.1 +V3.1 +V1.1 +V4.1 +V5.1 | 15.29,108.85 L2.1 | C16.2 v17.78,6.19 IC2.4 | C23.2 v37.47,6.19 IC5.4 | C26.2 v55.24,6.19 IC1.4 | IC18.8 11.21,86.77 11.69,86.77 13.97,89.05 v13.97,95.25 | v13.97,108.9 15.24,108.9 15.29,108.85
  Bottom 0.305: v17.78,6.19 22.7,6.19 24.13,7.62 35.72,7.62 37.15,6.19 v37.47,6.19 v55.24,6.19 61.12,6.19 66.04,11.11 66.04,89.75 67.23,90.95 67.23,91.36 67.31,91.44 67.31,105.41 +V4.1 | v13.97,95.25 v13.97,108.9
-5VREF  (via drill 0.35)
  Top 0.305: R71.1 R67.1 49.95,79.73 48.59,81.09 48.59,84.73 49.53,85.67 49.53,88.85 IC8.2 50.63,89.75 C6.2 54.18,89.75 R7.1 63.69,88.05 v64.45,87.29 | -5V3.1 -5V2.1 -5V.1 -5V1.1 | R29.1 64.35,79.02 v64.7,78.67 65.26,78.12 65.26,76.82 64.35,75.92 R13.1 | R85.1 v49,10.48 R84.1 R87.1 v43.4,10.48 R88.1 | R81.1 v31.22,10.48 R83.1 | R78.1 v23.71,10.48 R80.1 | R79.1 v11.53,10.48 R82.1 | v64.14,15.88 64.14,15.03 R89.1 v60.86,10.48 R86.1
  Bottom 0.305: 64.7,87.04 v64.7,78.67 64.7,16.44 v64.14,15.88 | 64.7,87.04 v64.45,87.29 | 64.7,87.04 64.7,92.78 -5V.1 | v60.86,10.48 55.7,10.48 54.92,9.69 54.27,9.69 53.48,10.48 v49,10.48 | v43.4,10.48 37.61,10.48 37.14,10.01 36.49,10.01 36.02,10.48 v31.22,10.48 v23.71,10.48 18.24,10.48 17.45,9.69 16.8,9.69 16.02,10.48 v11.53,10.48
-12V  (via drill 0.35)
  Top 0.305: 58.42,91.44 -V1.1 -V3.1 -V4.1 -V5.1 | C2.- 41.91,96.52 -V2.1 -V.1 58.42,91.44 | IC2.11 v17.78,14.76 C17.1 | C24.1 v37.47,14.76 IC5.11 | C25.1 v55.24,14.76 IC1.11 | R7.2 57.57,91.44 58.42,91.44 | IC18.4 18.16,88.61 19.26,87.5 22.02,87.5 22.86,88.34 22.86,89.53 24.13,90.81 24.13,93.03 25.08,93.98 33.02,93.98 36.83,90.17 v38.1,90.17
  Bottom 0.305: v17.78,14.76 22.38,14.76 23.81,13.34 36.04,13.34 v37.47,14.76 v55.24,14.76 64.29,14.76 65.53,16 65.53,90.93 -V4.1 | v38.1,90.17 44.45,96.52 -V2.1
A0
  Top 0.305: IC6.14-A0/TX3/SPDIF_OUT 49.11,58.42 50.81,60.12 61.8,60.12 16_A0.1
A1
  Top 0.305: IC6.15-A1/RX3/SPDIF_IN 63.5,60.96 16_A1.1
A2
  Top 0.305: 16_A2.1 63.5,63.5 IC6.16-A2/RX4/SCL1
A3
  Top 0.305: IC6.17-A3/TX4/SDA1 62.23,66.04 67.31,60.96 17_A3.1
A5
  Top 0.305: R116.1 IC6.19-A5/SCL0 47.68,71.12 50.87,67.93 62.88,67.93 64.77,66.04 19_A5_SCL.1
A6  (via drill 0.35)
  Top 0.305: C14.2 R68.2 v54.21,73.64 IC3.14
  Bottom 0.305: IC6.20-A6/TX5/LRCLK1 54.19,73.66 v54.21,73.64
A7  (via drill 0.35)
  Top 0.305: IC3.1 v60.09,73.64 R8.2 C7.2
  Bottom 0.305: IC6.21-A7/RX5/BCLK1 55.88,76.2 58.44,73.64 v60.09,73.64
A8  (via drill 0.35)
  Top 0.305: IC3.7 v60.09,81.3 R15.2 C10.2
  Bottom 0.305: IC6.22-A8/CTX1 57.47,78.74 60.03,81.3 v60.09,81.3
A9  (via drill 0.35)
  Top 0.305: C11.2 R64.2 54.21,81.3 v54.21,81.28 IC3.8
  Bottom 0.305: IC6.23-A9/CRX1/MCLK1 v54.21,81.28
A10
  Bottom 0.305: IC6.24-A10/TX6/SCL2 30.48,51.44 33.02,53.98 33.02,88.9 31.75,90.17 5.08,90.17 24_A10.1
A11
  Bottom 0.305: IC6.25-A11/RX6/SDA2 30.48,48.9 33.53,51.94 33.53,89.11 31.96,90.68 4.87,90.68 3.09,88.9 25_A11.1
A12
  Bottom 0.305: IC6.26-A12/MOSI1 30.48,46.35 34.04,49.91 34.04,89.32 32.17,91.19 1.52,91.19 26_A12.1
A13
  Bottom 0.305: 27_A13.1 3.56,91.69 32.38,91.69 34.54,89.53 34.54,48.14 30.48,44.08 IC6.27-A13/SCK1
A14
  Top 0.305: 38_A14.1 58.42,43.18 IC6.38-A14/CS/IN1
A15
  Top 0.305: 39_A15.1 58.42,45.72 IC6.39-A15/CS/OUT1A
A16
  Top 0.305: IC6.40-A16/CS1 58.42,48.26 40_A16.1
A17
  Top 0.305: IC6.41-A17/MISO1 58.42,50.8 41_A17.1
DAC1  (via drill 0.35)
  Top 0.305: v6.35,16.51 5.08,15.24 IN6.1 | R46.1 v29.84,14.29
  Bottom 0.305: v6.35,16.51 6.99,17.14 26.99,17.14 v29.84,14.29
DAC2  (via drill 0.35)
  Top 0.305: R20.1 v29.84,6.35 | v6.35,3.81 5.08,2.54 IN5.1
  Bottom 0.305: v29.84,6.35 27.3,3.81 v6.35,3.81
IN1
  Top 0.305: IC15.1 IC15.20 24.59,57.08 IC12.1 24.68,56.27 24.61,56.2 24.61,54.92 24.68,54.86 IC12.20 24.77,51.03 IC4.1 24.77,36.03 24.61,35.88 24.61,34.92 24.77,34.77 IC4.20 24.77,29.53 28.19,26.1 28.19,14.03 28.89,13.34 31.75,13.34 32.38,13.97 C22.2 R45.2 35.52,15.39 IC5.14
IN2
  Top 0.305: IC15.10 IC15.11 18.74,71.13 18.41,70.8 18.41,58.42 18.83,58.01 IC12.10 IC12.11 18.83,49.49 18.46,49.12 18.46,38.37 18.91,37.92 IC4.10 IC4.11 18.91,29.39 18.41,28.89 18.41,23.24 19.37,22.29 26.46,22.29 27.69,21.06 27.69,9.68 C12.2 R19.2 35.52,5.57 IC5.1
IN3
  Top 0.305: IC16.1 IC16.20 16.51,71.12 17.14,70.48 17.14,58.42 16.61,57.88 IC13.1 IC13.20 16.61,49.3 16.78,49.12 16.78,39.46 16.69,39.37 IC10.1 IC10.20 16.69,29.66 17.46,28.89 17.46,22.54 18.22,21.78 26.25,21.78 27.18,20.85 27.18,9.63 22.86,5.31 C31.2 R52.2 19.73,5.57 IC2.7
IN4
  Top 0.305: IC16.10 IC16.11 10.67,70.99 10.48,70.8 10.48,58.42 10.76,58.14 IC13.10 IC13.11 10.76,49.67 10.52,49.44 10.52,38.37 10.84,38.05 IC10.10 IC10.11 10.84,29.26 10.16,28.57 10.16,22.86 11.75,21.27 26.04,21.27 26.67,20.64 26.67,13.97 26.04,13.34 23.81,13.34 22.86,14.29 C20.2 R47.2 19.73,15.39 IC2.8
IN5
  Top 0.305: IC17.1 IC17.20 8.45,71.25 8.89,70.8 8.89,58.42 8.53,58.06 IC14.1 IC14.20 8.53,49.57 8.84,49.26 8.84,39.46 8.62,39.24 IC11.1 IC11.20 8.62,29.16 9.21,28.57 9.21,22.86 8.57,22.23 8.57,13.97 9.53,13.02 10.48,13.02 12.7,15.24 C18.2 R38.2 15.83,15.39 IC2.14
IN6
  Top 0.305: IC17.10 IC17.11 2.6,71.17 1.91,70.48 1.91,58.74 2.68,57.96 IC14.10 IC14.11 2.68,49.67 2.22,49.21 2.22,38.42 2.77,37.87 IC11.10 IC11.11 2.77,30.07 2.22,29.53 2.22,24.13 7.94,18.41 7.94,9.53 12.48,4.98 C21.2 R55.2 15.83,5.57 IC2.1
N$1
  Top 0.305: IC4.2 24.11,39.8 R10.2
N$2
  Top 0.305: R77.2 C18.1 R38.1 16.48,16.44 IC2.13 16.51,13.39 16.51,12.38 15.88,11.75 R82.2
N$3
  Top 0.305: IC1.1 53.3,5.57 C4.2 51.59,4.98 50.73,5.83 49.34,5.83 48.48,4.98 R3.1
N$4
  Top 0.305: OUT1.1 64.41,0.91 52.4,0.91 R1.2 R3.2
N$5  (via drill 0.35)
  Top 0.305: IC14.8 3.98,53.66 | 3.98,53.66 IC14.13 | IC13.8 12.05,53.34 | 12.05,53.34 IC13.13 | IC14.18 v7.23,53.66 | v7.23,53.66 IC14.3 | IC13.18 v15.3,53.66 15.3,53.98 | 15.3,53.98 IC13.3 | IC12.8 20.13,53.98 | 20.13,53.98 IC12.13 | IC12.3 v23.38,53.66 | v23.38,53.66 IC12.18 | IC17.8 3.9,74.61 | 3.9,74.61 IC17.13 | IC17.18 v7.14,74.78 | v7.14,74.78 7.14,74.93 | IC17.3 7.14,74.93 | IC16.8 11.97,74.61 | 11.97,74.61 IC16.13 | IC16.18 v15.22,74.78 15.22,74.93 | 15.22,74.93 IC16.3 | IC15.8 20.04,74.61 | 20.04,74.61 IC15.13 | IC15.3 23.29,74.93 | 23.29,74.93 v23.29,74.78 IC15.18 | IC10.13 12.14,33.66 | 12.14,33.66 IC10.8 | IC11.8 4.07,33.66 | 4.07,33.66 IC11.13 | IC11.3 7.32,34.29 | IC11.18 v7.32,33.66 7.32,34.29 | IC10.3 15.39,34.29 | IC10.18 v15.39,33.66 15.39,34.29 | IC4.8 20.21,33.66 | 20.21,33.66 IC4.13 | IC4.3 23.46,34.29 | IC4.18 v23.46,33.66 23.46,34.29 | 3.9,74.61 5.56,74.61 5.71,74.76 6.98,74.76 | 7.14,74.93 6.98,74.76 | 11.97,74.61 13.49,74.61 13.64,74.76 15.05,74.76 15.22,74.93 | 20.04,74.61 21.75,74.61 21.9,74.76 23.12,74.76 23.29,74.93 | 3.98,53.66 5.88,53.66 6.03,53.81 7.08,53.81 v7.23,53.66 | 12.05,53.34 13.18,53.34 13.64,53.81 15.14,53.81 15.3,53.98 | v23.38,53.66 22.7,53.66 22.55,53.81 20.3,53.81 20.13,53.98 | 4.07,33.66 5.54,33.66 5.7,33.8 6.83,33.8 7.32,34.29 | 15.39,34.29 14.13,34.29 13.66,33.82 12.31,33.82 12.14,33.66 | 23.46,34.29 22.38,34.29 21.91,33.82 20.38,33.82 20.21,33.66 | 6.98,74.76 7.13,74.76 v7.14,74.78 | v17.78,83.82 v17.78,74.78 v17.78,53.66 v17.78,33.66 | IC18.2 IC18.1 17.32,86.66 v18.1,85.88
  Bottom 0.305: v7.14,74.78 v15.22,74.78 v17.78,74.78 v23.29,74.78 | v7.23,53.66 v15.3,53.66 v17.78,53.66 v23.38,53.66 | v7.32,33.66 v15.39,33.66 v17.78,33.66 v23.46,33.66 | v17.78,83.82 17.78,85.56 v18.1,85.88
N$6
  Top 0.305: IC1.7 57.2,5.57 C5.2 58.77,4.98 59.63,5.83 61.02,5.83 61.88,4.98 R6.1
N$7
  Top 0.305: OUT2.1 64.24,3.28 R6.2 R4.2
N$8
  Top 0.305: IC3.2 61.41,76.17 R13.2 R11.2 | R11.2 R12.2 C7.1 | R11.2 R8.1
N$9
  Top 0.305: IC18.3 18.09,87.95 19.05,87 22.54,87 24.13,88.58 R93.2
N$10
  Top 0.305: IC1.8 57.2,15.39 C8.2 58.77,15.98 59.63,15.12 61.02,15.12 61.88,15.98 R14.1
N$11
  Top 0.305: R9.2 R14.2 64.24,17.68 66.48,15.43 66.48,14.08 66.99,13.57 66.99,11.75 OUT3.1
N$12
  Top 0.305: R76.2 C20.1 R47.1 19.08,16.44 IC2.9 19.05,13.39 19.05,12.38 19.68,11.75 R80.2
N$13
  Top 0.305: CV7B.1 64.77,69.85 R12.1
N$14
  Top 0.305: CV7.1 64.77,72.39 R11.1
N$15
  Top 0.305: IC1.14 53.3,15.39 C9.2 51.72,15.98 50.86,15.12 49.47,15.12 48.61,15.98 R18.1
N$16
  Top 0.305: R62.2 R63.2 C10.1 | R62.2 R29.2 61.41,78.77 IC3.6 | R62.2 R15.1
N$17
  Top 0.305: OUT4.1 66.99,14.29 66.99,15.88 62.87,20 52.07,20 50.16,18.1 R16.2 R18.2
N$18
  Top 0.305: CV6.1 64.77,82.55 R62.1
N$19
  Top 0.305: CV6B.1 64.77,85.09 R63.1
N$20
  Top 0.305: R20.2 C12.1 R19.1 36.16,4.52 IC5.2 36.2,7.57 36.2,8.57 35.56,9.21 R81.2
N$21
  Top 0.305: IC18.6 IC18.7
N$22
  Top 0.305: IC4.9 19.57,39.99 R17.2
N$23
  Top 0.305: IC10.2 16.04,39.94 R21.2
N$24
  Top 0.305: IC10.9 11.49,40.05 R22.2
N$26
  Top 0.305: IC11.2 7.97,40.08 R23.2
N$27
  Top 0.305: IC11.9 3.42,40.03 R24.2
N$28
  Top 0.305: R75.2 C31.1 R52.1 19.08,4.52 IC2.6 19.05,7.57 19.05,8.57 19.68,9.21 R78.2
N$29
  Top 0.305: IC11.12 3.42,28.23 R25.1
N$30
  Top 0.305: IC11.19 7.97,28.19 R26.1
N$31
  Top 0.305: IC10.12 11.49,28.22 R27.1
N$32
  Top 0.305: IC10.19 16.04,28.32 R28.1
N$33
  Top 0.203: 39.41,5.57 C13.2 41.06,4.98 41.87,5.78 43.22,5.78 44.03,4.98 R41.1
  Top 0.305: 39.41,5.57 IC5.7
N$34
  Top 0.305: IC4.12 19.57,28.27 R2.1
N$35
  Top 0.305: IC4.19 24.11,28.17 R5.1
N$36
  Top 0.305: IC12.2 24.03,59.58 R30.2
N$37
  Top 0.305: IC12.9 19.37,57.1 R31.2
N$38
  Top 0.305: IC13.2 15.96,60.03 R35.2
N$39
  Top 0.305: IC13.9 11.4,60.09 R32.2
N$40
  Top 0.305: IC14.2 7.88,60.05 R33.2
N$41
  Top 0.305: IC14.9 3.33,59.95 R34.2
N$42
  Top 0.305: OUT5.1 66.45,0.41 44.45,0.41 42.55,2.31 R39.2 R41.2
N$43
  Top 0.305: R95.2 26.67,91.22 R93.1
N$44
  Top 0.203: C19.2 40.75,15.98 41.55,15.17 43.54,15.17 44.34,15.98 R44.1
  Top 0.305: C19.2 39.41,15.39 IC5.8
N$45
  Top 0.305: R115.1 IC6.18-A4/SDA0 49.5,68.58 50.66,67.42 62.12,67.42 66.04,63.5 18_A4_SDA.1
N$46
  Top 0.305: IC14.12 3.33,48.63 R49.1
N$47
  Top 0.305: OUT6.1 63.18,20.64 45.51,20.64 R42.2 R44.2
N$48
  Top 0.305: R46.2 C22.1 R45.1 36.16,16.44 IC5.13 36.2,13.39 36.2,12.38 35.56,11.75 R83.2
N$49
  Top 0.305: R93.3 21.59,90.91 R94.1
N$50
  Top 0.305: R74.2 C21.1 R55.1 16.48,4.52 IC2.2 16.51,7.57 16.51,8.57 15.88,9.21 R79.2
N$51
  Top 0.305: L1.2 21.59,106.31 IC7.1 20.95,102.55 C28.2
N$52
  Top 0.305: IC14.19 7.88,48.53 R48.1
N$53
  Top 0.305: IC13.12 11.4,48.5 R43.1
N$54
  Top 0.305: IC13.19 15.96,48.55 R40.1
N$55
  Top 0.305: IC12.12 19.48,48.59 R37.1
N$56
  Top 0.305: IC12.19 24.03,48.69 R36.1
N$57
  Top 0.305: IC3.13 51.68,76.17 R71.2 R69.2 | R69.2 R70.2 52.49,71.12 C14.1 | R69.2 52.49,73.66 R68.1
N$58
  Top 0.305: IC15.2 23.94,81.25 R57.2
N$59
  Top 0.305: IC15.9 19.39,81.36 R56.2
N$60
  Top 0.305: CV8.1 65.35,68.58 65.21,68.44 51.08,68.44 49.09,70.42 49.09,71.82 49.95,72.67 R69.1
N$61
  Top 0.305: IC16.2 15.87,81.38 R54.2
N$62
  Top 0.305: IC16.9 11.32,81.27 R53.2
N$63
  Top 0.305: IC17.2 7.79,81.24 R51.2
N$64
  Top 0.305: IC17.9 3.25,81.31 R50.2
N$65
  Top 0.305: IC17.12 3.25,69.18 R73.1
N$66
  Top 0.305: IC17.19 7.79,68.97 R72.1
N$67
  Top 0.305: IC16.12 11.32,68.91 R61.1
N$68
  Top 0.305: R70.1 50.1,71.12 52.27,68.94 65,68.94 67.17,71.12 CV8B.1
N$69
  Top 0.305: R66.1 50.1,83.82 52.27,86 65,86 67.17,83.82 CV5B.1
N$70
  Top 0.305: CV5.1 65.35,86.36 65.21,86.5 51.08,86.5 49.09,84.52 49.09,83.12 49.95,82.27 R65.1
N$71
  Top 0.305: R65.2 R66.2 52.49,83.82 C11.1 | R65.2 R67.2 51.68,78.77 IC3.9 | R65.2 52.49,81.28 R64.1
N$72
  Top 0.305: IC9.3 12.62,102.55 C29.2 L2.2
N$73
  Top 0.305: IC16.19 15.87,68.8 R60.1
N$75
  Top 0.305: IC15.12 19.39,68.82 R59.1
N$76
  Top 0.305: IC15.19 23.94,69.24 R58.1
N$78  (via drill 0.35)
  Top 0.305: R75.1 v25.4,6.35 | v6.35,6.35 5.08,5.08 IN1.1
  Bottom 0.305: v6.35,6.35 8.26,6.35 9.53,5.08 24.13,5.08 v25.4,6.35
N$79  (via drill 0.35)
  Top 0.305: R76.1 v25.4,14.29 | v6.35,13.97 5.08,12.7 IN2.1
  Bottom 0.305: v6.35,13.97 8.26,13.97 10.16,15.88 23.81,15.88 v25.4,14.29
N$80  (via drill 0.35)
  Top 0.305: R77.1 v10.16,14.29 | v6.35,11.43 5.08,10.16 IN3.1
  Bottom 0.305: v6.35,11.43 7.3,11.43 v10.16,14.29
N$81  (via drill 0.35)
  Top 0.305: R74.1 10.08,5.06 v10.08,6.27 | v6.35,8.89 5.08,7.62 IN4.1
  Bottom 0.305: v6.35,8.89 7.46,8.89 v10.08,6.27
N$108
  Bottom 0.305: 28.1 5.59,92.2 32.59,92.2 35.05,89.74 35.05,46.11 30.48,41.54 IC6.28-RX7
N$109
  Bottom 0.305: 29.1 7.62,92.71 32.8,92.71 35.56,89.95 35.56,44.08 30.48,39 IC6.29-TX7
N$110
  Bottom 0.305: 30.1 9.65,93.22 33.01,93.22 36.07,90.16 36.07,42.05 30.48,36.46 IC6.30-CRX3
N$111
  Bottom 0.305: 31.1 11.68,93.73 33.22,93.73 36.58,90.37 36.58,40.02 30.48,33.92 IC6.31-CTX3
N$112
  Bottom 0.305: 32.1 13.72,94.23 33.43,94.23 37.08,90.58 37.08,37.98 30.48,31.38 IC6.32-OUT1B
N$118
  Top 0.305: 34.1 58.42,33.02 IC6.34-RX8
N$119
  Top 0.305: 35.1 58.42,35.56 IC6.35-TX8
N$120
  Top 0.305: 33.1 58.42,30.48 IC6.33-MCLK2
N$121
  Top 0.305: 36.1 58.42,38.1 IC6.36-PWM
N$122
  Top 0.305: 37.1 58.42,40.64 IC6.37-PWM
OUT1  (via drill 0.35)
  Top 0.305: R24.1 v3.49,43.18 | v23.81,43.18 R10.1 | R17.1 v19.68,43.18 | R21.1 v15.88,43.18 | R22.1 v11.43,43.18 | R23.1 v7.94,43.18 | C9.1 52.65,17.73 52.7,17.78 v52.7,19.05 | C9.1 53.95,16.44 IC1.13 53.98,13.39 53.98,12.38 53.34,11.75 R85.2 | R16.1 51.87,17.68 C9.1
  Bottom 0.305: v23.81,43.18 v19.68,43.18 v15.88,43.18 v11.43,43.18 v7.94,43.18 v3.49,43.18 2.48,42.16 2.48,21.99 3.19,21.27 50.48,21.27 v52.7,19.05
OUT2  (via drill 0.35)
  Top 0.305: R25.2 3.57,26.38 v3.57,25.16 | v24.13,25.08 R5.2 | R2.2 v19.68,25.16 | R28.2 v15.88,25.16 | R27.2 v11.43,25.16 | R26.2 v7.94,25.16 | C8.1 57.47,17.68 56.55,16.75 IC1.9 56.55,12.67 57.47,11.75 R89.2 | R9.1 58.62,17.68 C8.1 | v57.78,19.05 C8.1
  Bottom 0.305: v24.13,25.08 24.05,25.16 v19.68,25.16 v15.88,25.16 v11.43,25.16 v7.94,25.16 v3.57,25.16 2.98,24.57 2.98,22.2 3.4,21.78 55.05,21.78 v57.78,19.05
OUT3  (via drill 0.35)
  Top 0.305: R34.1 v3.17,63.18 | v23.5,63.18 R30.1 | R31.1 v19.37,63.18 | R35.1 v15.88,63.18 | R32.1 v11.43,63.18 | R33.1 v7.94,63.18 | C13.1 38.77,4.52 IC5.6 38.77,8.29 39.69,9.21 R87.2 | C13.1 40.84,3.28 R39.1 | v40.01,1.91 C13.1
  Bottom 0.305: v23.5,63.18 v19.37,63.18 v15.88,63.18 v11.43,63.18 v7.94,63.18 v3.17,63.18 2.41,63.18 1.46,62.23 1.46,21.57 4,19.03 4,2.5 5.08,1.42 39.52,1.42 v40.01,1.91
OUT4  (via drill 0.35)
  Top 0.305: R49.2 3.81,47.09 v5.08,47.09 7.62,47.09 R48.2 | R43.2 11.75,47.09 v13.65,47.09 15.56,47.09 R40.2 | R37.2 19.68,47.09 v21.59,47.09 23.5,47.09 R36.2 | v40.32,19.05 40.01,18.73 C19.1 | C19.1 38.77,16.44 IC5.9 38.77,12.67 39.69,11.75 R88.2 | C19.1 40.84,17.68 R42.1
  Bottom 0.305: v21.59,47.09 v13.65,47.09 v5.08,47.09 2.64,47.09 1.97,46.42 1.97,21.78 2.98,20.77 38.61,20.77 v40.32,19.05
OUT5  (via drill 0.35)
  Top 0.305: R53.1 11.43,83.82 v12.7,85.09 15.88,85.09 | R57.1 21.8,85.09 19.37,85.09 | 15.88,85.09 19.37,85.09 | R54.1 15.88,85.09 | R56.1 19.37,85.09 | R50.1 3.17,83.19 v5.08,85.09 6.99,85.09 7.94,84.14 R51.1 | C5.1 56.55,4.52 IC1.6 56.55,8.29 57.47,9.21 R86.2 | R4.1 58.62,3.28 C5.1 | v57.78,1.91 C5.1
  Bottom 0.305: v12.7,85.09 v5.08,85.09 0.41,80.42 0.41,21.18 2.86,18.73 2.86,1.91 4.36,0.41 56.29,0.41 v57.78,1.91
OUT6  (via drill 0.35)
  Top 0.305: R59.2 19.58,67.31 v21.59,67.31 23.28,67.31 R58.2 | R72.2 7.41,67.31 v5.08,67.31 3.07,67.31 R73.2 | R61.2 11.64,67.31 v13.34,67.31 15.66,67.31 R60.2 | C4.1 53.95,4.52 IC1.2 53.98,7.57 53.98,8.57 53.34,9.21 R84.2 | R1.1 51.74,3.28 C4.1 | v52.7,1.91 C4.1
  Bottom 0.305: v21.59,67.31 v13.34,67.31 v5.08,67.31 1.91,67.31 0.95,66.36 0.95,21.36 3.49,18.82 3.49,2.18 4.76,0.91 51.71,0.91 v52.7,1.91
PE  (via drill 0.35)
  Top 0.305: GND4.1 42.55,101.6 C2.+ 40.32,101.92 C1.- 34.92,101.6 C3.- | IC3.3 v57.15,76.82 | v57.15,76.82 IC3.12 IC3.11 IC3.10 | C15.1 63.49,78.33 61.95,78.33 61.75,78.12 IC3.5 58.45,78.12 v57.15,76.82 | IC9.2-2 IC9.2 8.89,102.14 C30.- 13.65,100.33 C29.1 C28.1 C27.1 17.04,98.32 18.1,99.38 IC7.2 | v53.98,87.95 53.87,88.05 C6.1 52.6,87.95 IC8.1 | IC17.7 4.54,78.84 v5.4,79.69 | IC16.7 12.62,78.97 v13.34,79.69 | IC15.7 20.69,78.96 v22.52,80.79 | IC14.7 4.63,57.97 v5.4,58.74 | IC13.7 12.71,58.11 v13.34,58.74 | IC12.7 20.78,57.92 v21.59,58.74 | IC2.12 17.13,11.11 | 17.13,11.11 v17.13,10.48 17.13,9.84 | 17.13,9.84 IC2.3 | IC2.5 18.43,8.54 17.13,9.84 | IC2.10 18.43,12.41 17.13,11.11 | IC5.12 36.81,11.11 | 36.81,11.11 v36.81,10.79 36.81,10.16 | 36.81,10.16 IC5.3 | IC5.10 38.12,12.41 36.81,11.11 | IC1.3 54.59,9.84 | 54.59,11.11 v54.59,10.48 54.59,9.84 | 54.59,11.11 IC1.12 | IC1.10 55.9,12.41 54.59,11.11 | IC1.5 55.9,8.54 54.59,9.84 | IC5.5 38.12,8.88 36.83,10.16 36.81,10.16 | C25.2 v55.24,19.05 | C26.1 v55.24,1.91 | C24.2 v37.47,19.03 | C23.1 36.41,2.22 v36.2,2.22 | v19.05,2.21 18.85,2.21 C16.1 | C17.2 v17.78,19.03 | GND9.1 GND8.1 GND6.1 GND7.1 | IC6.GND6 43.69,88.39 40.52,88.39 40.02,88.9 IC6.GND1 29.21,87.63 25.72,87.63 25.5,87.84 R95.1 | IC11.7 4.74,37.01 4.74,37.74 5.08,38.08 v5.08,38.32 | IC10.7 12.79,37.78 v13.34,38.32 | IC4.7 20.86,37.92 v21.27,38.32 | IC18.5 9.19,88.61 v8.89,88.9
  pour Bottom: 0,110.49 69.85,110.49 69.85,0 0,0
SDO  (via drill 0.35)
  Top 0.305: IC11.16 v6.02,32.7 | v26.04,32.7 26.04,34.77 26.18,34.92 v26.18,52.7 v26.18,73.66 | IC14.16 5.93,52.6 v6.03,52.7 | IC13.16 14.01,52.67 v13.97,52.7 | IC12.16 22.08,52.56 v22.23,52.7 | v22.23,73.66 21.99,73.42 IC15.16 | IC16.16 13.92,73.61 v13.97,73.66 | IC17.16 5.84,73.47 v6.03,73.66 | v22.23,32.7 22.16,32.64 IC4.16 | v14.29,32.7 14.09,32.51 IC10.16
  Bottom 0.305: v6.02,32.7 v14.29,32.7 v22.23,32.7 v26.04,32.7 | v26.18,52.7 v22.23,52.7 v13.97,52.7 v6.03,52.7 | v26.18,73.66 v22.23,73.66 v13.97,73.66 v6.03,73.66
SPI_CS
  Top 0.305: 10_CS.1 59.61,54.69 55.39,54.69 54.19,55.88 CS.1 52.49,55.88 51.29,57.07 45.24,57.07 41.48,60.83 30.61,60.83 IC6.10-CS\MQSR
SPI_CS1  (via drill 0.35)
  Top 0.305: IC4.4 22.82,38.23 22.39,38.65 22.39,43.64 v23.18,44.43
  Bottom 0.305: v23.18,44.43 23.45,44.7 27.09,44.7 28.96,46.57 28.96,61.98 IC6.9-OUT1C
SPI_CS2  (via drill 0.35)
  Top 0.305: IC10.4 14.74,38.36 14.46,38.65 14.46,44.47 v14.92,44.94
  Bottom 0.305: v14.92,44.94 15.2,45.21 26.88,45.21 28.45,46.78 28.45,64.01 IC6.8-TX2/IN1
SPI_CS3  (via drill 0.35)
  Top 0.305: IC11.4 6.67,38.26 6.2,38.73 6.2,44.94 v6.99,45.72
  Bottom 0.305: IC6.7-RX2/OUT1A 28.83,66.93 28.83,66.68 27.94,65.79 27.94,46.99 26.67,45.72 v6.99,45.72
SPI_CS4  (via drill 0.35)
  Top 0.305: IC12.4 22.73,58.32 22.39,58.65 22.39,64.3 v22.86,64.77
  Bottom 0.305: v22.86,64.77 23.16,65.06 24.43,65.06 IC6.6-OUT1D
SPI_CS5  (via drill 0.35)
  Top 0.305: IC13.4 14.65,58.38 14.39,58.65 14.39,65.04 v14.92,65.57
  Bottom 0.305: IC6.5-IN2 27.81,70.99 27.81,69.64 23.75,65.57 v14.92,65.57
SPI_CS6  (via drill 0.35)
  Top 0.305: IC14.4 6.58,57.96 6.24,58.3 6.24,58.7 6.2,58.73 v6.2,65.89
  Bottom 0.305: IC6.4-BCLK2 27.3,73.03 27.3,69.85 23.81,66.36 6.67,66.36 v6.2,65.89
SPI_CS7  (via drill 0.35)
  Top 0.305: IC15.4 22.64,79.16 v22.86,79.38
  Bottom 0.305: IC6.3-LRCLK2 29.84,79.38 v22.86,79.38
SPI_CS8  (via drill 0.35)
  Top 0.305: IC16.4 14.57,80.46 v14.61,80.5
  Bottom 0.305: v14.61,80.5 15.88,81.77 30,81.77 IC6.2-OUT2
SPI_CS9  (via drill 0.35)
  Top 0.305: IC17.4 6.5,80.16 v6.67,80.33
  Bottom 0.305: IC6.1-TX1/MISO1/CTX2 29.21,82.55 8.89,82.55 v6.67,80.33
SPI_MISO
  Top 0.305: 12_MISO.1 59.69,52.07 54.61,52.07 MISO.1 47.36,55.88 46.2,54.72 45.24,54.72 44.08,55.88 IC6.12-MISO/MQSL
SPI_MOSI  (via drill 0.35)
  Top 0.305: IC17.6 v5.2,75.56 | IC16.6 13.27,75.63 v13.34,75.56 | IC15.6 21.34,75.81 v21.59,75.56 | IC11.6 5.25,36.87 5.25,36.14 5.08,35.97 v5.08,34.61 | v26.99,34.61 v26.99,54.61 26.99,58.42 | 26.99,58.42 v26.99,75.56 | IC10.6 13.44,34.72 v13.34,34.61 | IC4.6 21.52,34.68 v21.59,34.61 | IC14.6 5.28,54.73 v5.4,54.61 | IC13.6 13.36,54.63 v13.34,54.61 | IC12.6 21.43,54.77 v21.59,54.61 | 26.99,58.42 IC6.11-MOSI/CTX1 41.91,58.42 v43.18,57.15 | MOSI.1 51.65,58.42 52.85,59.61 59.77,59.61 11_MOSI.1
  Bottom 0.305: v5.2,75.56 v13.34,75.56 v21.59,75.56 v26.99,75.56 | v5.08,34.61 v13.34,34.61 v21.59,34.61 v26.99,34.61 | v5.4,54.61 v13.34,54.61 v21.59,54.61 v26.99,54.61 | v43.18,57.15 47.19,57.15 47.63,57.58 49.96,57.58 MOSI.1
SPI_SCK  (via drill 0.35)
  Top 0.305: IC17.5 5.96,77.83 5.96,77.1 5.98,77.09 v5.98,76.52 | IC15.5 21.99,76.84 v22.31,76.52 | IC16.5 13.92,76.65 v14.05,76.52 | v6.35,55.56 5.93,55.98 IC14.5 | IC13.5 14.01,55.84 v14.29,55.56 | IC12.5 22.08,55.71 v22.23,55.56 | v25.4,35.56 v25.4,55.56 v25.4,76.52 27.3,76.52 28.26,75.56 28.26,61.28 29.95,59.58 42.02,59.58 IC6.13-SCK/LED | v6.03,35.56 6.03,36.98 IC11.5 | IC10.5 14.09,35.76 v14.29,35.56 | IC4.5 22.16,35.94 v22.54,35.56 | SCK.1 54.19,58.42 55.39,57.23 59.61,57.23 13_SCK.1
  Bottom 0.305: v5.98,76.52 v14.05,76.52 v22.31,76.52 v25.4,76.52 | v25.4,55.56 v22.23,55.56 v14.29,55.56 v6.35,55.56 | v25.4,35.56 v22.54,35.56 v14.29,35.56 v6.03,35.56 | IC6.13-SCK/LED 46.64,55.88 47.84,57.07 51.99,57.07 SCK.1

### Text on the board
tNames: 12V | 5V | 3.3VA | 3.3V | GND | 3.3V REG | -5V | -12V | GND | Rob Ellis 2022 | Teensy Matrix Mixer v1.2 | ANALOG IN | ANALOG OUT
bNames: 12V | GND | -12V